# Altium project MB1167.PrjPCB (part 1 of 3)
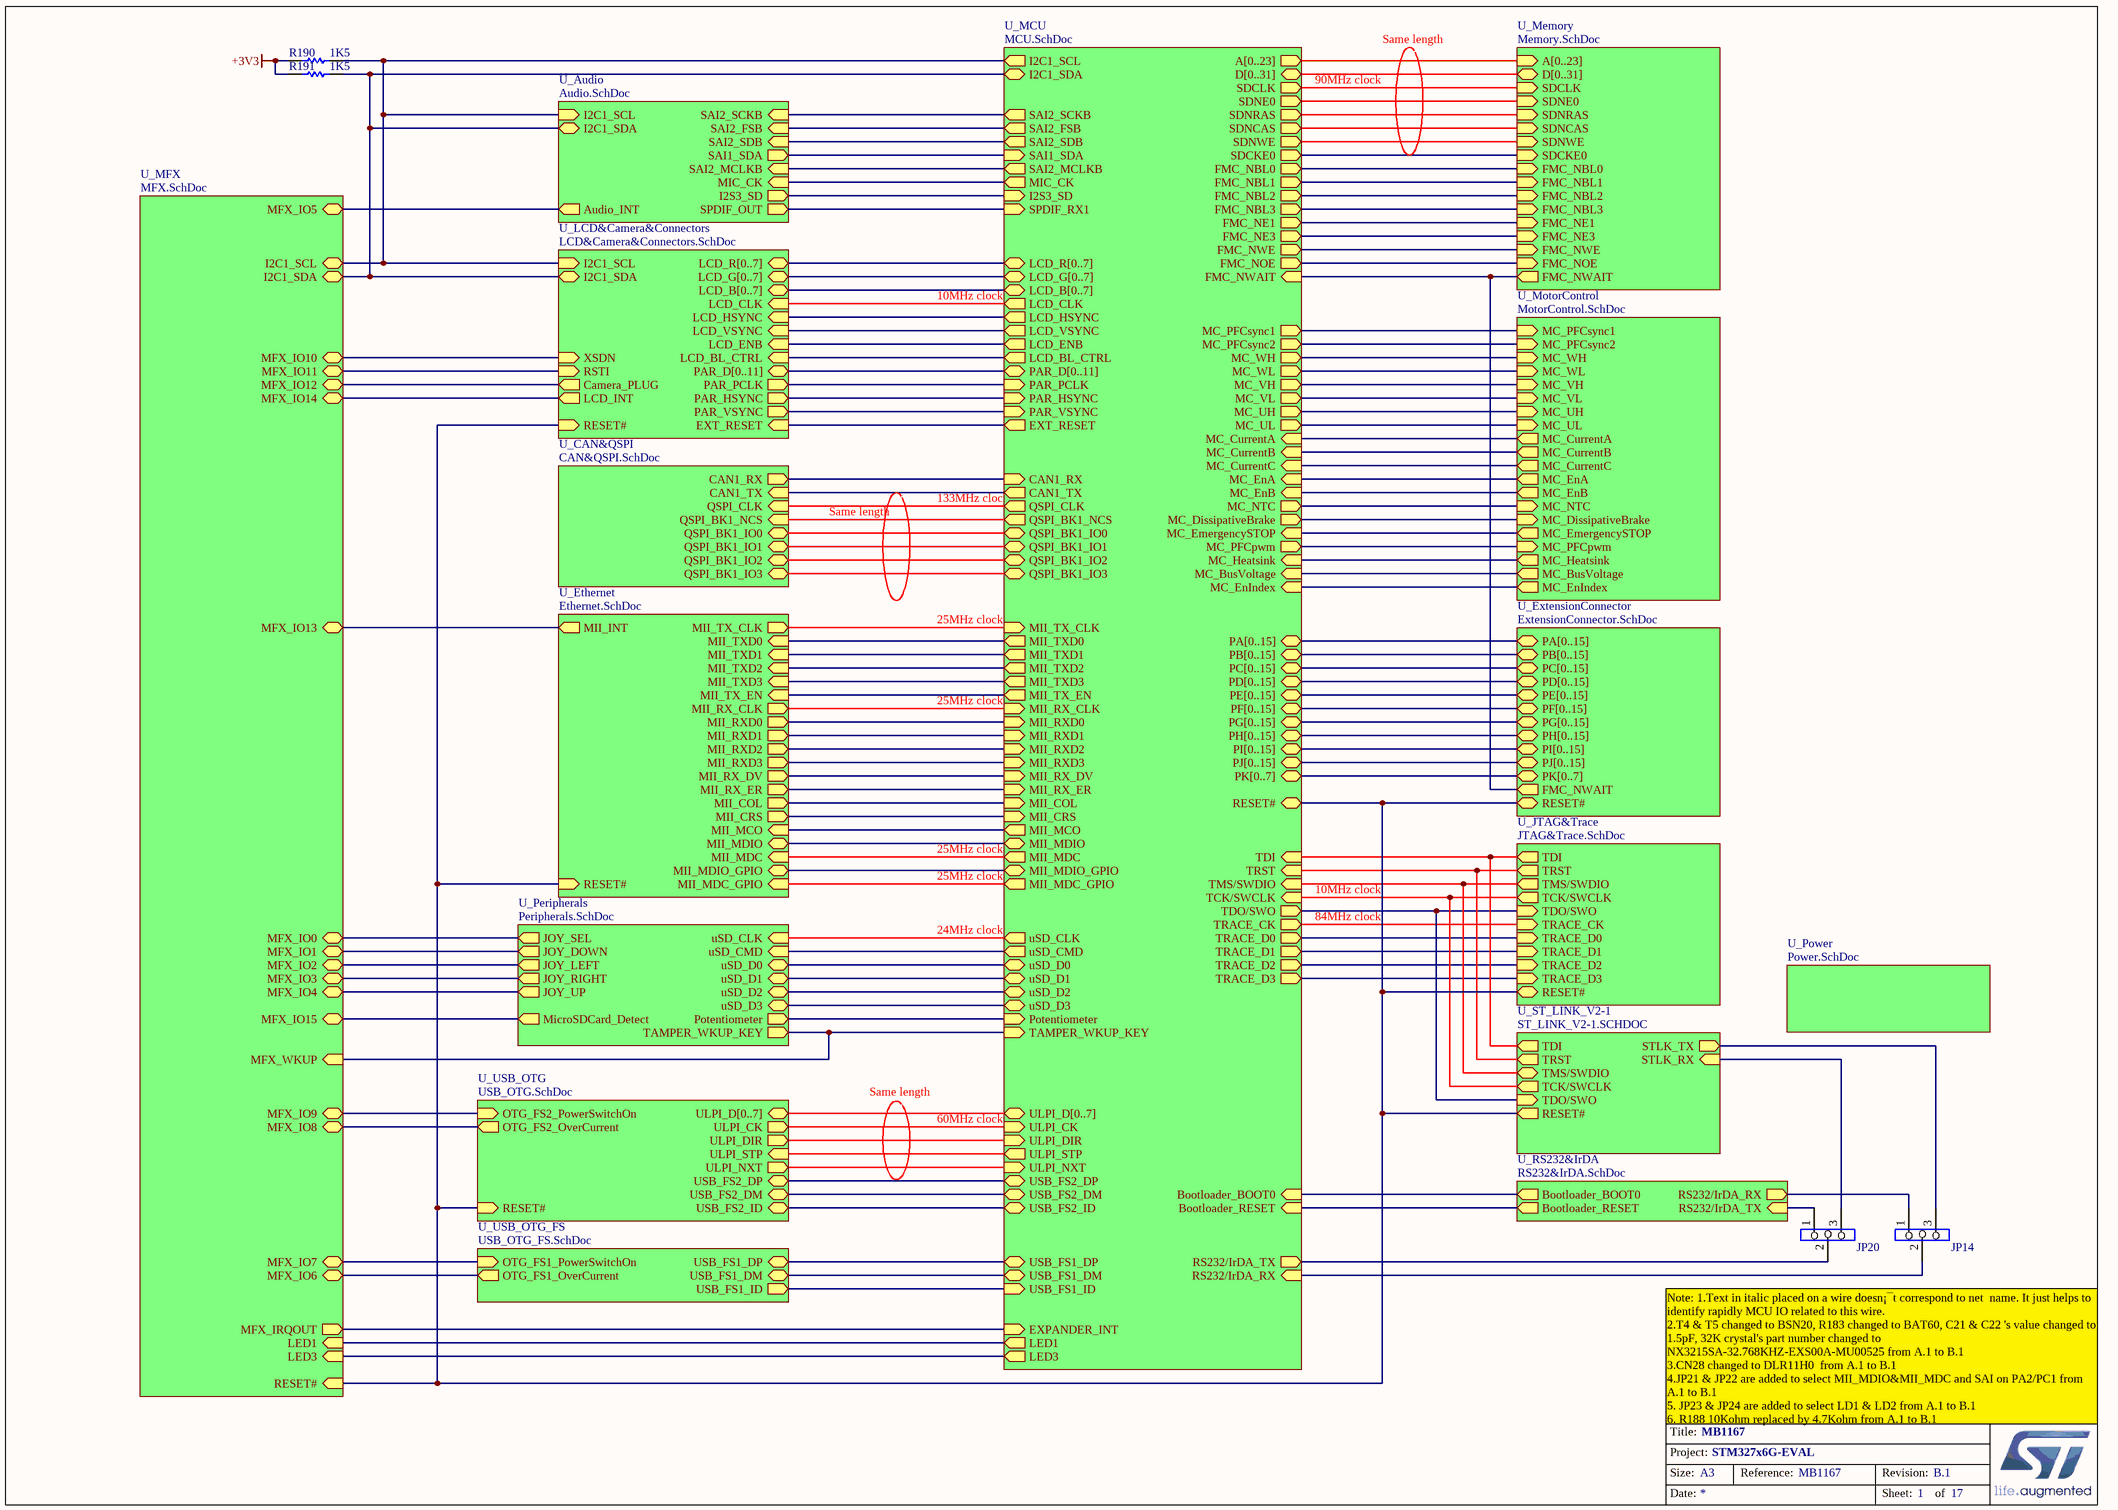
[diagram p0: MB1167.SchDoc]
17 sheets, 691 parts. Net scope: hierarchical (ports join the sheet entries above them; power ports are global).
Sheets:
  MB1167.SchDoc
    U_Audio = Audio.SchDoc
    U_CAN&QSPI = CAN&QSPI.SchDoc
    U_Ethernet = Ethernet.SchDoc
    U_ExtensionConnector = ExtensionConnector.SchDoc
    U_JTAG&Trace = JTAG&Trace.SchDoc
    U_Memory = Memory.SchDoc
    U_MotorControl = MotorControl.SchDoc
    U_Peripherals = Peripherals.SchDoc
    U_Power = Power.SchDoc
    U_ST_LINK_V2-1 = ST_LINK_V2-1.SCHDOC
    U_USB_OTG = USB_OTG.SchDoc
    U_USB_OTG_FS = USB_OTG_FS.SchDoc
    U_RS232&IrDA = RS232&IrDA.SchDoc
    U_LCD&Camera&Connectors = LCD&Camera&Connectors.SchDoc
    U_MFX = MFX.SchDoc
    U_MCU = MCU.SchDoc

## Sheet MB1167.SchDoc: MB1167
size A3; DocumentNumber: MB1167; Revision: B.1; SheetNumber: 1; SheetTotal: 17; Project: STM327x6G-EVAL

### Parts
JP14  (no value)  [SIP3]
JP20  (no value)  [SIP3]
R190  1K5  [0603R]
R191  1K5  [0603R]

### Sub-sheets
U_Audio = Audio.SchDoc: SAI2_SCKB (in), SAI2_FSB (in), SAI2_SDB (in), SAI1_SDA (out), Audio_INT (out), I2C1_SDA (bidir), I2C1_SCL (in), SAI2_MCLKB (in), MIC_CK (in), I2S3_SD (out), SPDIF_OUT (out)
U_CAN&QSPI = CAN&QSPI.SchDoc: CAN1_TX (in), CAN1_RX (out), QSPI_BK1_IO0 (bidir), QSPI_BK1_IO3 (bidir), QSPI_BK1_IO2 (bidir), QSPI_BK1_IO1 (bidir), QSPI_CLK (in), QSPI_BK1_NCS (in)
U_Ethernet = Ethernet.SchDoc: MII_TXD0 (in), MII_TX_EN (in), MII_TX_CLK (out), MII_RXD0 (out), MII_RX_ER (out), MII_RX_DV (out), MII_RX_CLK (out), MII_COL (out), MII_CRS (out), MII_MDC (in), MII_MDIO (bidir), RESET# (in), MII_TXD1 (in), MII_TXD2 (in), MII_TXD3 (in), MII_RXD1 (out), MII_RXD2 (out), MII_RXD3 (out), MII_INT (out), MII_MCO (in), MII_MDIO_GPIO (bidir), MII_MDC_GPIO (in)
U_ExtensionConnector = ExtensionConnector.SchDoc: PA[0..15] (bidir), PB[0..15] (bidir), PC[0..15] (bidir), PD[0..15] (bidir), PE[0..15] (bidir), PF[0..15] (bidir), PG[0..15] (bidir), PH[0..15] (bidir), PI[0..15] (bidir), PJ[0..15] (bidir), PK[0..7] (bidir), RESET# (bidir), FMC_NWAIT (out)
U_JTAG&Trace = JTAG&Trace.SchDoc: TDI (out), RESET# (bidir), TRACE_D3 (in), TRACE_D2 (in), TRACE_D1 (in), TRACE_D0 (in), TRACE_CK (in), TRST (out), TMS/SWDIO (out), TCK/SWCLK (out), TDO/SWO (in)
U_LCD&Camera&Connectors = LCD&Camera&Connectors.SchDoc: LCD_R[0..7] (bidir), LCD_HSYNC (in), LCD_VSYNC (in), LCD_CLK (in), LCD_ENB (in), LCD_BL_CTRL (in), I2C1_SDA (bidir), I2C1_SCL (in), LCD_B[0..7] (bidir), LCD_G[0..7] (bidir), RSTI (in), XSDN (in), PAR_HSYNC (out), PAR_PCLK (out), PAR_VSYNC (out), PAR_D[0..11] (bidir), EXT_RESET (in), LCD_INT (out), Camera_PLUG (out), RESET# (in)
U_MCU = MCU.SchDoc: PA[0..15] (bidir), PB[0..15] (bidir), PC[0..15] (bidir), PD[0..15] (bidir), PE[0..15] (bidir), PF[0..15] (bidir), PG[0..15] (bidir), PH[0..15] (bidir), PI[0..15] (bidir), MC_EnA (in), MII_RX_CLK (in), MC_EnB (in), MII_MDIO (bidir), MC_EnIndex (in), ULPI_CK (in), MC_EmergencySTOP (in), MII_RX_DV (in), MC_UL (out), LCD_BL_CTRL (out), MC_PFCsync1 (out), RS232/IrDA_TX (out), RS232/IrDA_RX (in), USB_FS1_ID (in), CAN1_RX (in), USB_FS1_DM (bidir), MC_PFCpwm (out), CAN1_TX (out), USB_FS1_DP (bidir), MC_PFCsync2 (out), TMS/SWDIO (in), TCK/SWCLK (in), TDI (in), MC_VL (out), MC_WL (out), TDO/SWO (out), MIC_CK (out), TRST (in), I2C1_SCL (out), MII_TXD3 (out), MC_DissipativeBrake (out), I2C1_SDA (bidir), USB_FS2_ID (bidir), USB_FS2_DM (bidir), USB_FS2_DP (bidir), ULPI_STP (out), MII_MDC (out), MC_CurrentA (in), MII_TXD2 (out), MC_CurrentB (in), MII_TX_CLK (in), MC_CurrentC (in), MII_RXD0 (in), MC_BusVoltage (in), MII_RXD1 (in), MC_Heatsink (in), MC_UH (out), MC_VH (out), uSD_D0 (bidir), MC_WH (out), uSD_D1 (bidir), uSD_D2 (bidir), EXT_RESET (out), uSD_D3 (bidir), uSD_CLK (out), TAMPER_WKUP_KEY (in), MII_CRS (in), LCD_ENB (out), uSD_CMD (out), FMC_NOE (out), FMC_NWE (out), FMC_NWAIT (in), I2S3_SD (in), FMC_NE1 (out), FMC_NBL3 (out), FMC_NBL2 (out), EXPANDER_INT (in), MII_RX_ER (in), ULPI_DIR (in), LCD_HSYNC (out), LCD_VSYNC (out), LCD_CLK (out), FMC_NBL0 (out), FMC_NBL1 (out), TRACE_CK (out), TRACE_D0 (out), TRACE_D2 (out), TRACE_D1 (out), SAI1_SDA (in), TRACE_D3 (out), SAI2_SDB (out), SAI2_SCKB (out), SAI2_FSB (out), SAI2_MCLKB (out), Potentiometer (in), SDNRAS (out), MII_MDIO_GPIO (bidir), MII_MDC_GPIO (out), SDCLK (out), FMC_NE3 (out), SPDIF_RX1 (in), MII_TX_EN (out), MC_NTC (out), MII_TXD0 (out), MII_TXD1 (out), SDNCAS (out), SDCKE0 (out), SDNE0 (out), MII_COL (in), ULPI_NXT (in), SDNWE (out), MII_RXD2 (in), MII_RXD3 (in), LCD_G[0..7] (bidir), LCD_B[0..7] (bidir), D[0..31] (bidir), A[0..23] (out), ULPI_D[0..7] (bidir), RESET# (bidir), PJ[0..15] (bidir), PK[0..7] (bidir), PAR_VSYNC (in), PAR_D[0..11] (bidir), PAR_PCLK (in), PAR_HSYNC (in), MII_MCO (out), LCD_R[0..7] (bidir), Bootloader_BOOT0 (in), QSPI_CLK (out), QSPI_BK1_NCS (out), QSPI_BK1_IO3 (bidir), QSPI_BK1_IO2 (bidir), QSPI_BK1_IO1 (bidir), QSPI_BK1_IO0 (bidir), Bootloader_RESET (in), LED1 (out), LED3 (out)
U_Memory = Memory.SchDoc: FMC_NE1 (in), FMC_NWE (in), FMC_NOE (in), FMC_NWAIT (out), FMC_NBL0 (in), FMC_NBL1 (in), D[0..31] (bidir), A[0..23] (in), SDNCAS (in), SDNWE (in), SDNRAS (in), SDNE0 (in), SDCKE0 (in), SDCLK (in), FMC_NBL3 (in), FMC_NBL2 (in), FMC_NE3 (in)
U_MFX = MFX.SchDoc: I2C1_SDA (bidir), I2C1_SCL (bidir), MFX_IO5 (bidir), MFX_IO6 (bidir), MFX_IO7 (bidir), MFX_IO8 (bidir), MFX_IO9 (bidir), MFX_IO10 (bidir), MFX_IO11 (bidir), MFX_IO12 (bidir), MFX_IO13 (bidir), MFX_IO14 (bidir), MFX_IO15 (bidir), MFX_IO0 (bidir), MFX_IO1 (bidir), MFX_IO2 (bidir), MFX_IO3 (bidir), MFX_IO4 (bidir), MFX_IRQOUT (out), MFX_WKUP (in), RESET# (in), LED1 (in), LED3 (in)
U_MotorControl = MotorControl.SchDoc: MC_EmergencySTOP (out), MC_CurrentA (out), MC_CurrentB (out), MC_CurrentC (out), MC_PFCsync1 (in), MC_PFCsync2 (in), MC_WL (in), MC_VH (in), MC_VL (in), MC_UH (in), MC_UL (in), MC_WH (in), MC_NTC (in), MC_DissipativeBrake (in), MC_PFCpwm (in), MC_EnA (out), MC_EnB (out), MC_Heatsink (out), MC_BusVoltage (out), MC_EnIndex (out)
U_Peripherals = Peripherals.SchDoc: JOY_SEL (out), JOY_DOWN (out), JOY_LEFT (out), JOY_RIGHT (out), JOY_UP (out), Potentiometer (out), TAMPER_WKUP_KEY (out), uSD_CLK (in), uSD_CMD (in), uSD_D0 (bidir), uSD_D1 (bidir), uSD_D2 (bidir), uSD_D3 (bidir), MicroSDCard_Detect (out)
U_Power = Power.SchDoc: no entries
U_RS232&IrDA = RS232&IrDA.SchDoc: RS232/IrDA_TX (in), RS232/IrDA_RX (out), Bootloader_BOOT0 (out), Bootloader_RESET (out)
U_ST_LINK_V2-1 = ST_LINK_V2-1.SCHDOC: STLK_RX (in), STLK_TX (out), TDI (out), TRST (out), TMS/SWDIO (bidir), TCK/SWCLK (out), TDO/SWO (in), RESET# (out)
U_USB_OTG = USB_OTG.SchDoc: ULPI_D[0..7] (bidir), ULPI_CK (out), ULPI_DIR (out), ULPI_NXT (out), ULPI_STP (in), RESET# (in), USB_FS2_DM (bidir), USB_FS2_DP (bidir), OTG_FS2_PowerSwitchOn (in), OTG_FS2_OverCurrent (out), USB_FS2_ID (bidir)
U_USB_OTG_FS = USB_OTG_FS.SchDoc: OTG_FS1_PowerSwitchOn (in), OTG_FS1_OverCurrent (out), USB_FS1_DM (bidir), USB_FS1_DP (bidir), USB_FS1_ID (out)

### Nets
+3V3: R190.1 R191.1
I2C1_SCL: R190.2 ; sheet U_Audio/I2C1_SCL, sheet U_LCD&Camera&Connectors/I2C1_SCL, sheet U_MFX/I2C1_SCL, sheet U_MCU/I2C1_SCL
I2C1_SDA: R191.2 ; sheet U_Audio/I2C1_SDA, sheet U_LCD&Camera&Connectors/I2C1_SDA, sheet U_MFX/I2C1_SDA, sheet U_MCU/I2C1_SDA
PA4: sheet U_LCD&Camera&Connectors/PAR_HSYNC, sheet U_MCU/PAR_HSYNC
PA5: sheet U_USB_OTG/ULPI_CK, sheet U_MCU/ULPI_CK
PA6: sheet U_MotorControl/MC_EmergencySTOP, sheet U_MCU/MC_EmergencySTOP
PA10: JP14.2 ; sheet U_USB_OTG_FS/USB_FS1_ID, sheet U_MCU/RS232/IrDA_RX, sheet U_MCU/USB_FS1_ID
PA11: sheet U_USB_OTG_FS/USB_FS1_DM, sheet U_MCU/USB_FS1_DM
PA13: sheet U_JTAG&Trace/TMS/SWDIO, sheet U_ST_LINK_V2-1/TMS/SWDIO, sheet U_MCU/TMS/SWDIO
PA14: sheet U_JTAG&Trace/TCK/SWCLK, sheet U_ST_LINK_V2-1/TCK/SWCLK, sheet U_MCU/TCK/SWCLK
PA15: sheet U_JTAG&Trace/TDI, sheet U_ST_LINK_V2-1/TDI, sheet U_MCU/TDI
PAR_D1: sheet U_MotorControl/MC_VH, sheet U_MCU/MC_VH
PAR_D8: sheet U_LCD&Camera&Connectors/EXT_RESET, sheet U_MCU/EXT_RESET
PAR_D9: sheet U_Peripherals/uSD_CLK, sheet U_MCU/uSD_CLK
PB2: sheet U_CAN&QSPI/QSPI_CLK, sheet U_MCU/QSPI_CLK
PB4: sheet U_JTAG&Trace/TRST, sheet U_ST_LINK_V2-1/TRST, sheet U_MCU/TRST
PB6: sheet U_CAN&QSPI/QSPI_BK1_NCS, sheet U_MCU/QSPI_BK1_NCS
PB14: sheet U_USB_OTG/USB_FS2_DM, sheet U_MCU/USB_FS2_DM
PB15: sheet U_USB_OTG/USB_FS2_DP, sheet U_MCU/USB_FS2_DP
PC0: sheet U_USB_OTG/ULPI_STP, sheet U_MCU/ULPI_STP
PC13: sheet U_Peripherals/TAMPER_WKUP_KEY, sheet U_MFX/MFX_WKUP, sheet U_MCU/TAMPER_WKUP_KEY
PD4: sheet U_Memory/FMC_NOE, sheet U_MCU/FMC_NOE
PD5: sheet U_Memory/FMC_NWE, sheet U_MCU/FMC_NWE
PD7: sheet U_Memory/FMC_NE1, sheet U_MCU/FMC_NE1
PE0: sheet U_Memory/FMC_NBL0, sheet U_MCU/FMC_NBL0
PE1: sheet U_Memory/FMC_NBL1, sheet U_MCU/FMC_NBL1
PF6: sheet U_CAN&QSPI/QSPI_BK1_IO3, sheet U_MCU/QSPI_BK1_IO3
PF7: sheet U_CAN&QSPI/QSPI_BK1_IO2, sheet U_MCU/QSPI_BK1_IO2
PF8: sheet U_CAN&QSPI/QSPI_BK1_IO0, sheet U_MCU/QSPI_BK1_IO0
PF9: sheet U_CAN&QSPI/QSPI_BK1_IO1, sheet U_MCU/QSPI_BK1_IO1
PF11: sheet U_Memory/SDNRAS, sheet U_MCU/SDNRAS
PG8: sheet U_Memory/SDCLK, sheet U_MCU/SDCLK
PG9: sheet U_Audio/SAI2_FSB, sheet U_MCU/SAI2_FSB
PG10: sheet U_Memory/FMC_NE3, sheet U_MCU/FMC_NE3
PG12: sheet U_Audio/SPDIF_OUT, sheet U_MCU/SPDIF_RX1
PG15: sheet U_Memory/SDNCAS, sheet U_MCU/SDNCAS
PH2: sheet U_Memory/SDCKE0, sheet U_MCU/SDCKE0
PH3: sheet U_Memory/SDNE0, sheet U_MCU/SDNE0
PH4: sheet U_USB_OTG/ULPI_NXT, sheet U_MCU/ULPI_NXT
PH5: sheet U_Memory/SDNWE, sheet U_MCU/SDNWE
PH7: sheet U_Ethernet/MII_RXD3, sheet U_MCU/MII_RXD3
PI4: sheet U_Memory/FMC_NBL2, sheet U_MCU/FMC_NBL2
PI5: sheet U_Memory/FMC_NBL3, sheet U_MCU/FMC_NBL3
PI8: sheet U_MFX/MFX_IRQOUT, sheet U_MCU/EXPANDER_INT
PI11: sheet U_USB_OTG/ULPI_DIR, sheet U_MCU/ULPI_DIR
PI12: sheet U_LCD&Camera&Connectors/LCD_HSYNC, sheet U_MCU/LCD_HSYNC
PI13: sheet U_LCD&Camera&Connectors/LCD_VSYNC, sheet U_MCU/LCD_VSYNC
PI14: sheet U_LCD&Camera&Connectors/LCD_CLK, sheet U_MCU/LCD_CLK
PK7: sheet U_LCD&Camera&Connectors/LCD_ENB, sheet U_MCU/LCD_ENB
RESET#: sheet U_Ethernet/RESET#, sheet U_ExtensionConnector/RESET#, sheet U_JTAG&Trace/RESET#, sheet U_ST_LINK_V2-1/RESET#, sheet U_USB_OTG/RESET#, sheet U_LCD&Camera&Connectors/RESET#, sheet U_MFX/RESET#, sheet U_MCU/RESET#
STLINK_RX: JP20.3 ; sheet U_ST_LINK_V2-1/STLK_RX
STLINK_TX: JP14.3 ; sheet U_ST_LINK_V2-1/STLK_TX
T_JTDO: sheet U_JTAG&Trace/TDO/SWO, sheet U_ST_LINK_V2-1/TDO/SWO, sheet U_MCU/TDO/SWO
NetB3_1: sheet U_Peripherals/JOY_LEFT, sheet U_MFX/MFX_IO2
NetB3_2: sheet U_Peripherals/JOY_SEL, sheet U_MFX/MFX_IO0
NetB3_3: sheet U_Peripherals/JOY_DOWN, sheet U_MFX/MFX_IO1
NetB3_4: sheet U_Peripherals/JOY_RIGHT, sheet U_MFX/MFX_IO3
NetB3_6: sheet U_Peripherals/JOY_UP, sheet U_MFX/MFX_IO4
NetC6_2: sheet U_MotorControl/MC_EnA, sheet U_MCU/MC_EnA
NetC7_2: sheet U_MotorControl/MC_PFCsync2, sheet U_MCU/MC_PFCsync2
NetC8_2: sheet U_MotorControl/MC_EnB, sheet U_MCU/MC_EnB
NetC9_2: sheet U_MotorControl/MC_EnIndex, sheet U_MCU/MC_EnIndex
NetC10_2: sheet U_MotorControl/MC_PFCpwm, sheet U_MCU/MC_PFCpwm
NetC11_1: sheet U_MotorControl/MC_Heatsink, sheet U_MCU/MC_Heatsink
NetC12_2: sheet U_MotorControl/MC_CurrentC, sheet U_MCU/MC_CurrentC
NetC13_2: sheet U_MotorControl/MC_CurrentB, sheet U_MCU/MC_CurrentB
NetC14_2: sheet U_MotorControl/MC_CurrentA, sheet U_MCU/MC_CurrentA
NetC15_1: sheet U_MotorControl/MC_BusVoltage, sheet U_MCU/MC_BusVoltage
NetC18_2: sheet U_MotorControl/MC_PFCsync1, sheet U_MCU/MC_PFCsync1
NetCN1_3: sheet U_MotorControl/MC_UH, sheet U_MCU/MC_UH
NetCN1_5: sheet U_MotorControl/MC_UL, sheet U_MCU/MC_UL
NetCN1_9: sheet U_MotorControl/MC_VL, sheet U_MCU/MC_VL
NetCN1_11: sheet U_MotorControl/MC_WH, sheet U_MCU/MC_WH
NetCN1_13: sheet U_MotorControl/MC_WL, sheet U_MCU/MC_WL
NetCN1_21: sheet U_MotorControl/MC_NTC, sheet U_MCU/MC_NTC
NetCN1_23: sheet U_MotorControl/MC_DissipativeBrake, sheet U_MCU/MC_DissipativeBrake
NetCN4_15: sheet U_LCD&Camera&Connectors/Camera_PLUG, sheet U_MFX/MFX_IO12
NetCN4_17: sheet U_LCD&Camera&Connectors/RSTI, sheet U_MFX/MFX_IO11
NetCN4_19: sheet U_LCD&Camera&Connectors/XSDN, sheet U_MFX/MFX_IO10
NetCN4_32: sheet U_LCD&Camera&Connectors/PAR_VSYNC, sheet U_MCU/PAR_VSYNC
NetCN4_33: sheet U_LCD&Camera&Connectors/PAR_PCLK, sheet U_MCU/PAR_PCLK
NetCN11_6: sheet U_ExtensionConnector/FMC_NWAIT, sheet U_Memory/FMC_NWAIT, sheet U_MCU/FMC_NWAIT
NetCN12_12: sheet U_JTAG&Trace/TRACE_CK, sheet U_MCU/TRACE_CK
NetCN12_14: sheet U_JTAG&Trace/TRACE_D0, sheet U_MCU/TRACE_D0
NetCN12_16: sheet U_JTAG&Trace/TRACE_D1, sheet U_MCU/TRACE_D1
NetCN12_18: sheet U_JTAG&Trace/TRACE_D2, sheet U_MCU/TRACE_D2
NetCN12_20: sheet U_JTAG&Trace/TRACE_D3, sheet U_MCU/TRACE_D3
NetCN14_4: sheet U_USB_OTG/USB_FS2_ID, sheet U_MCU/USB_FS2_ID
NetCN16_1: sheet U_Peripherals/uSD_D2, sheet U_MCU/uSD_D2
NetCN16_2: sheet U_Peripherals/uSD_D3, sheet U_MCU/uSD_D3
NetCN16_3: sheet U_Peripherals/uSD_CMD, sheet U_MCU/uSD_CMD
NetCN16_7: sheet U_Peripherals/uSD_D0, sheet U_MCU/uSD_D0
NetCN16_8: sheet U_Peripherals/uSD_D1, sheet U_MCU/uSD_D1
NetCN20_39: sheet U_LCD&Camera&Connectors/LCD_INT, sheet U_MFX/MFX_IO14
NetCN20_43: sheet U_LCD&Camera&Connectors/LCD_BL_CTRL, sheet U_MCU/LCD_BL_CTRL
NetD1_1: sheet U_RS232&IrDA/Bootloader_BOOT0, sheet U_MCU/Bootloader_BOOT0
NetD5_C3: sheet U_USB_OTG_FS/USB_FS1_DP, sheet U_MCU/USB_FS1_DP
NetJP3_2: sheet U_RS232&IrDA/Bootloader_RESET, sheet U_MCU/Bootloader_RESET
NetJP5_3: sheet U_Audio/I2S3_SD, sheet U_MCU/I2S3_SD
NetJP6_3: sheet U_Ethernet/MII_MCO, sheet U_MCU/MII_MCO
NetJP7_2: JP14.1 ; sheet U_RS232&IrDA/RS232/IrDA_RX
NetJP8_2: sheet U_CAN&QSPI/CAN1_RX, sheet U_MCU/CAN1_RX
NetJP19_3: sheet U_Audio/MIC_CK, sheet U_MCU/MIC_CK
NetJP20_1: JP20.1 ; sheet U_RS232&IrDA/RS232/IrDA_TX
NetJP20_2: JP20.2 ; sheet U_MCU/RS232/IrDA_TX
NetJP21_1: sheet U_Audio/SAI2_SCKB, sheet U_MCU/SAI2_SCKB
NetJP21_3: sheet U_Ethernet/MII_MDIO, sheet U_Ethernet/MII_MDIO_GPIO, sheet U_MCU/MII_MDIO, sheet U_MCU/MII_MDIO_GPIO
NetJP22_1: sheet U_Audio/SAI1_SDA, sheet U_MCU/SAI1_SDA
NetJP22_3: sheet U_Ethernet/MII_MDC, sheet U_Ethernet/MII_MDC_GPIO, sheet U_MCU/MII_MDC, sheet U_MCU/MII_MDC_GPIO
NetJP23_3: sheet U_MFX/LED3, sheet U_MCU/LED3
NetJP24_1: sheet U_Peripherals/Potentiometer, sheet U_MCU/Potentiometer
NetJP24_3: sheet U_MFX/LED1, sheet U_MCU/LED1
NetR46_2: sheet U_Ethernet/MII_RXD2, sheet U_MCU/MII_RXD2
NetR47_2: sheet U_Ethernet/MII_RXD1, sheet U_MCU/MII_RXD1
NetR48_2: sheet U_Ethernet/MII_RXD0, sheet U_MCU/MII_RXD0
NetR49_2: sheet U_Ethernet/MII_RX_DV, sheet U_MCU/MII_RX_DV
NetR50_2: sheet U_Ethernet/MII_RX_CLK, sheet U_MCU/MII_RX_CLK
NetR62_2: sheet U_Ethernet/MII_TX_CLK, sheet U_MCU/MII_TX_CLK
NetR74_2: sheet U_Ethernet/MII_INT, sheet U_MFX/MFX_IO13
NetR121_1: sheet U_USB_OTG/OTG_FS2_OverCurrent, sheet U_MFX/MFX_IO8
NetR130_2: sheet U_USB_OTG_FS/OTG_FS1_PowerSwitchOn, sheet U_MFX/MFX_IO7
NetR132_1: sheet U_USB_OTG_FS/OTG_FS1_OverCurrent, sheet U_MFX/MFX_IO6
NetR154_1: sheet U_Peripherals/MicroSDCard_Detect, sheet U_MFX/MFX_IO15
NetR241_2: sheet U_Ethernet/MII_TXD2, sheet U_MCU/MII_TXD2
NetR243_2: sheet U_Ethernet/MII_TXD0, sheet U_MCU/MII_TXD0
NetR244_2: sheet U_Ethernet/MII_TXD1, sheet U_MCU/MII_TXD1
NetR247_1: sheet U_Ethernet/MII_TXD3, sheet U_MCU/MII_TXD3
NetR252_2: sheet U_Ethernet/MII_TX_EN, sheet U_MCU/MII_TX_EN
NetSB9_2: sheet U_Ethernet/MII_RX_ER, sheet U_MCU/MII_RX_ER
NetSB14_1: sheet U_USB_OTG/OTG_FS2_PowerSwitchOn, sheet U_MFX/MFX_IO9
NetSB18_1: sheet U_Audio/SAI2_MCLKB, sheet U_MCU/SAI2_MCLKB
NetSB32_1: sheet U_Audio/SAI2_SDB, sheet U_MCU/SAI2_SDB
NetSB36_1: sheet U_Ethernet/MII_CRS, sheet U_MCU/MII_CRS
NetSB47_2: sheet U_Ethernet/MII_COL, sheet U_MCU/MII_COL
NetSB49_1: sheet U_CAN&QSPI/CAN1_TX, sheet U_MCU/CAN1_TX
NetU22_15: sheet U_Audio/Audio_INT, sheet U_MFX/MFX_IO5

### Buses and harness runs
bus sheet U_ExtensionConnector/PA[0..15] = sheet U_MCU/PA[0..15]
bus sheet U_ExtensionConnector/PB[0..15] = sheet U_MCU/PB[0..15]
bus sheet U_ExtensionConnector/PC[0..15] = sheet U_MCU/PC[0..15]
bus sheet U_ExtensionConnector/PD[0..15] = sheet U_MCU/PD[0..15]
bus sheet U_ExtensionConnector/PE[0..15] = sheet U_MCU/PE[0..15]
bus sheet U_ExtensionConnector/PF[0..15] = sheet U_MCU/PF[0..15]
bus sheet U_ExtensionConnector/PG[0..15] = sheet U_MCU/PG[0..15]
bus sheet U_ExtensionConnector/PH[0..15] = sheet U_MCU/PH[0..15]
bus sheet U_ExtensionConnector/PI[0..15] = sheet U_MCU/PI[0..15]
bus sheet U_ExtensionConnector/PJ[0..15] = sheet U_MCU/PJ[0..15]
bus sheet U_ExtensionConnector/PK[0..7] = sheet U_MCU/PK[0..7]
bus sheet U_LCD&Camera&Connectors/LCD_B[0..7] = sheet U_MCU/LCD_B[0..7]
bus sheet U_LCD&Camera&Connectors/LCD_G[0..7] = sheet U_MCU/LCD_G[0..7]
bus sheet U_LCD&Camera&Connectors/LCD_R[0..7] = sheet U_MCU/LCD_R[0..7]
bus sheet U_LCD&Camera&Connectors/PAR_D[0..11] = sheet U_MCU/PAR_D[0..11]
bus sheet U_MCU/A[0..23] = sheet U_Memory/A[0..23]
bus sheet U_MCU/D[0..31] = sheet U_Memory/D[0..31]
bus sheet U_MCU/ULPI_D[0..7] = sheet U_USB_OTG/ULPI_D[0..7]

### Notes on the sheet
- Same length
- 90MHz clock
- 10MHz clock
- 133MHz clock
- 25MHz clock
- 84MHz clock
- 24MHz clock
- 60MHz clock
- Note: 1.Text in italic placed on a wire doesn¡¯t correspond to net  name. It just helps to identify rapidly MCU IO related to this wire.
  2.T4 & T5 changed to BSN20, R183 changed to BAT60, C21 & C22 's value changed to 1.5pF, 32K crystal's part number changed to NX3215SA-32.768KHZ-EXS00A-MU00525 from A.1 to B.1
  3.CN28 changed to DLR11H0  from A.1 to B.1
  4.JP21 & JP22 are added to select MII_MDIO&MII_MDC and SAI on PA2/PC1 from A.1 to B.1
  5. JP23 & JP24 are added to select LD1 & LD2 from A.1 to B.1
  6. R188 10Kohm replaced by 4.7Kohm from A.1 to B.1
- Title:
- Project:
- Size:
- Date:
- A3
- Reference:
- Sheet:
- Revision:
- of

### Library data of the parts
JP14 JP20 = Jumper3
R190 R191 = Res1: Resistor; Value: 1K; Published: 8-Jun-2000; Revision: July-2002: Re-released for DXP Platform.; Publisher: Altium Limited

## Sheet Audio.SchDoc: Audio
size A4; DocumentNumber: MB1167; Revision: B.1; SheetNumber: 5; SheetTotal: 17; Project: STM327x6G-EVAL
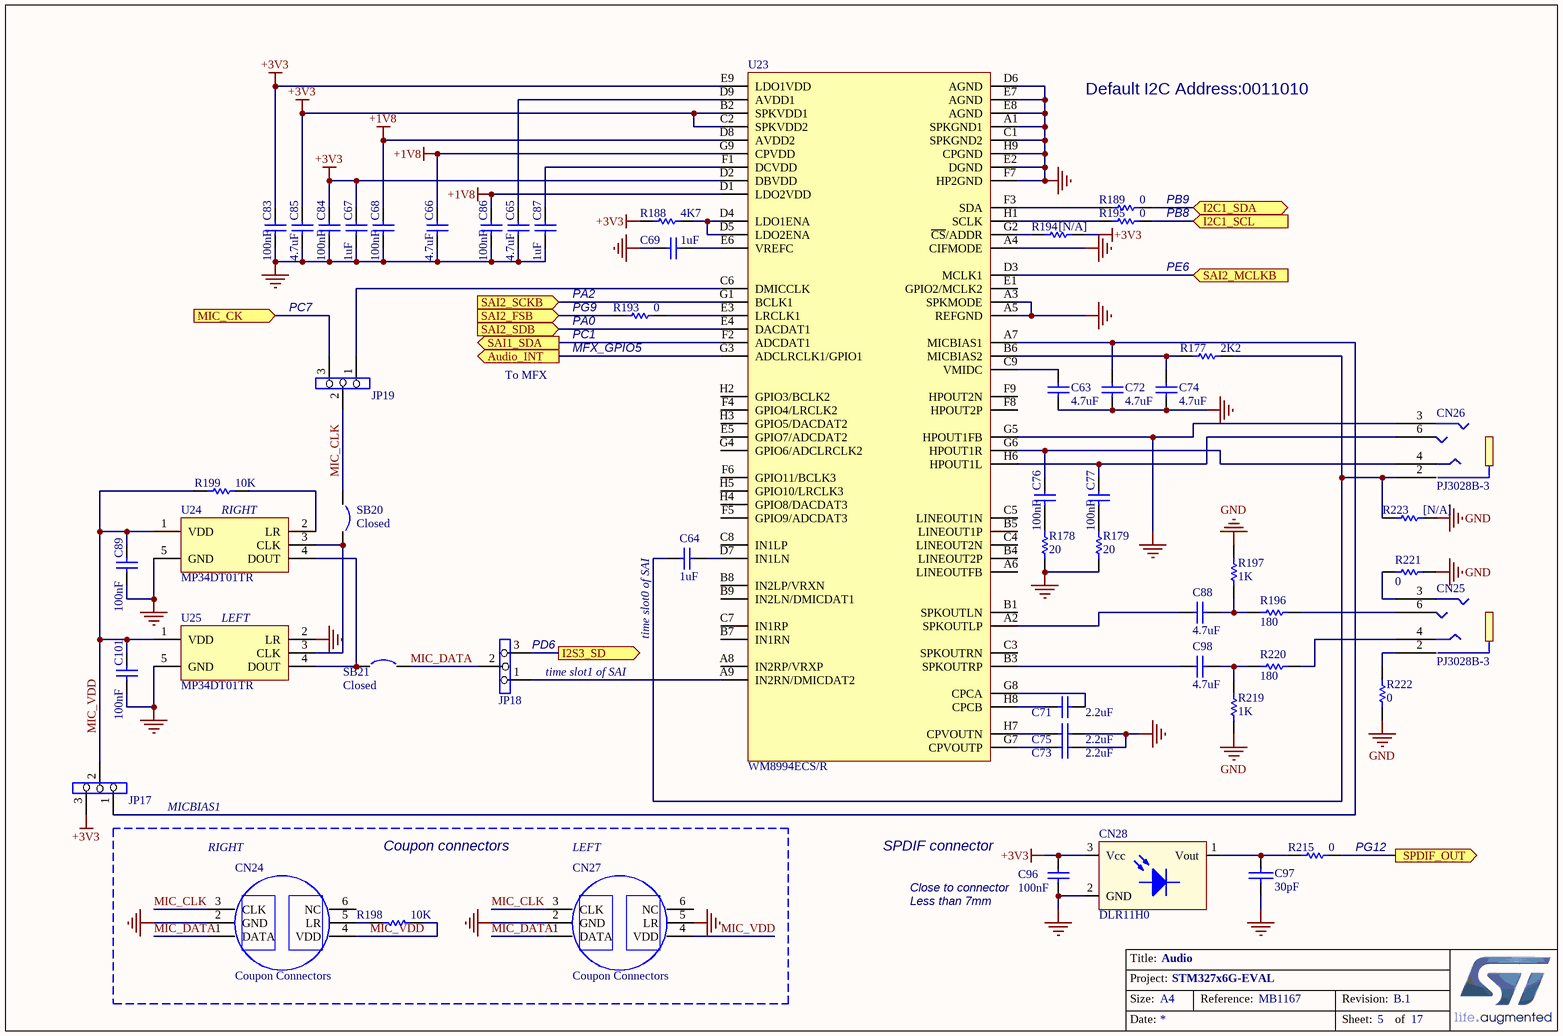
[diagram p1: Audio.SchDoc]

### Parts
C63  4.7uF  [0603C]
C64  1uF  [0603C]
C65  4.7uF  [0603C]
C66  4.7uF  [0603C]
C67  1uF  [0603C]
C68  100nF  [0603C]
C69  1uF  [0603C]
C71  2.2uF  [0603C]
C72  4.7uF  [0603C]
C73  2.2uF  [0603C]
C74  4.7uF  [0603C]
C75  2.2uF  [0603C]
C76  100nF  [0603C]
C77  100nF  [0603C]
C83  100nF  [0603C]
C84  100nF  [0603C]
C85  4.7uF  [0603C]
C86  100nF  [0603C]
C87  1uF  [0603C]
C88  4.7uF  [0603C]
C89  100nF  [0603C]
C96  100nF  [0603C]
C97  30pF  [0603C]
C98  4.7uF  [0603C]
C101  100nF  [0603C]
CN24  Coupon Connectors  [Coupon]
CN25  PJ3028B-3  [PJ3028B]
CN26  PJ3028B-3  [PJ3028B]
CN27  Coupon Connectors  [Coupon]
CN28  DLR11H0  [CONN_DLR11H0]
JP17  (no value)  [SIP3]
JP18  (no value)  [SIP3]
JP19  (no value)  [SIP3]
R177  2K2  [0603R]
R178  20  [0603R]
R179  20  [0603R]
R188  4K7  [0603R]
R189  0  [0603R]
R193  0  [0603R]
R194  [N/A]  [0603R]
R195  0  [0603R]
R196  180  [0402R]
R197  1K  [0402R]
R198  10K  [0603R]
R199  10K  [0603R]
R215  0  [0603R]
R219  1K  [0402R]
R220  180  [0402R]
R221  0  [0603R]
R222  0  [0603R]
R223  [N/A]  [0603R]
SB20  Closed  [SB_0603]
SB21  Closed  [SB_0603]
U23  WM8994ECS/R  [BGA72_0R5_4R5X4]
U24  MP34DT01TR  [MP34DT01TR]
U25  MP34DT01TR  [MP34DT01TR]

### Blocks framed on the sheet
Coupon connectors: CN24 CN27 R198

### Ports
Audio_INT (out), I2C1_SCL (in), I2C1_SDA (bidir), I2S3_SD (out), MIC_CK (in), SAI1_SDA (out), SAI2_FSB (in), SAI2_MCLKB (in), SAI2_SCKB (in), SAI2_SDB (in), SPDIF_OUT (out)

### Nets
+1V8: C66.1 C68.1 C86.1 U23.D1(LDO2VDD) U23.D8(AVDD2) U23.G9(CPVDD)
+3V3: C67.1 C83.1 C84.1 C85.1 C96.2 CN28.3(Vcc) JP17.3 R188.2 R194.1 U23.B2(SPKVDD1) U23.C2(SPKVDD2) U23.D2(DBVDD) U23.E9(LDO1VDD)
GND: C63.1 C65.2 C66.2 C67.2 C68.2 C69.2 C72.1 C73.2 C74.1 C75.2 C83.2 C84.2 C85.2 C86.2 C87.2 C89.2 C96.1 C97.2 C101.2 CN24.2(GND) CN26.3 CN27.2(GND) CN27.5(LR) CN28.2(GND) R178.2 R179.2 R197.2 R219.1 R221.2 R222.2 R223.1 U23.A1(SPKGND1) U23.A3(SPKMODE) U23.A4(CIFMODE) U23.A5(REFGND) U23.C1(SPKGND2) U23.D6(AGND) U23.E2(DGND) U23.E7(AGND) U23.E8(AGND) U23.F7(HP2GND) U23.G5(HPOUT1FB) U23.H9(CPGND) U24.5(GND) U25.2(LR) U25.5(GND)
I2C1_SCL: R195.1 ; port I2C1_SCL
I2C1_SDA: R189.1 ; port I2C1_SDA
MIC_CLK: CN24.3(CLK) CN27.3(CLK) JP19.2 SB20.1
MIC_DATA: CN24.1(DATA) CN27.1(DATA) JP18.2 SB21.2
MIC_VDD: C89.1 C101.1 CN24.4(VDD) CN27.4(VDD) JP17.2 R198.2 R199.2 U24.1(VDD) U25.1(VDD)
PG9: R193.2 ; port SAI2_FSB
PG12: R215.1 ; port SPDIF_OUT
NetC63_2: C63.2 U23.C9(VMIDC)
NetC64_1: C64.1 U23.D7(IN1LN)
NetC64_2: C64.2 CN26.2 R177.1 R223.2
NetC65_1: C65.1 U23.D9(AVDD1)
NetC69_1: C69.1 U23.E6(VREFC)
NetC71_1: C71.1 U23.H8(CPCB)
NetC71_2: C71.2 U23.G8(CPCA)
NetC72_2: C72.2 JP17.1 U23.A7(MICBIAS1)
NetC73_1: C73.1 U23.G7(CPVOUTP)
NetC74_2: C74.2 R177.2 U23.B6(MICBIAS2)
NetC75_1: C75.1 U23.H7(CPVOUTN)
NetC76_1: C76.1 CN26.4 U23.G6(HPOUT1R)
NetC76_2: C76.2 R178.1
NetC77_1: C77.1 CN26.6 U23.H6(HPOUT1L)
NetC77_2: C77.2 R179.1
NetC87_1: C87.1 U23.F1(DCVDD)
NetC88_1: C88.1 R196.1 R197.1
NetC88_2: C88.2 U23.A2(SPKOUTLP)
NetC97_1: C97.1 CN28.1(Vout) R215.2
NetC98_1: C98.1 R219.2 R220.2
NetC98_2: C98.2 U23.B3(SPKOUTRP)
NetCN24_5: CN24.5(LR) R198.1
NetCN25_2: CN25.2 R222.1
NetCN25_3: CN25.3 R221.1
NetCN25_4: CN25.4 R220.1
NetCN25_6: CN25.6 R196.2
NetJP5_3: JP18.3 ; port I2S3_SD
NetJP18_1: JP18.1 U23.A9(IN2RN/DMICDAT2)
NetJP19_1: JP19.1 U23.C6(DMICCLK)
NetJP19_3: JP19.3 ; port MIC_CK
NetJP21_1: U23.G1(BCLK1) ; port SAI2_SCKB
NetJP22_1: U23.F2(ADCDAT1) ; port SAI1_SDA
NetR188_1: R188.1 U23.D4(LDO1ENA) U23.D5(LDO2ENA)
NetR189_2: R189.2 U23.F3(SDA)
NetR193_1: R193.1 U23.E3(LRCLK1)
NetR194_2: R194.2 U23.G2(~{CS}/ADDR)
NetR195_2: R195.2 U23.H1(SCLK)
NetR199_1: R199.1 U24.2(LR)
NetSB18_1: U23.D3(MCLK1) ; port SAI2_MCLKB
NetSB20_2: SB20.2 U24.3(CLK) U25.3(CLK)
NetSB21_1: SB21.1 U24.4(DOUT) U25.4(DOUT)
NetSB32_1: U23.E4(DACDAT1) ; port SAI2_SDB
NetU22_15: U23.G3(ADCLRCLK1/GPIO1) ; port Audio_INT

Not connected (* = marked no-connect by the designer): CN24 6(NC); CN27 6(NC); U23 A6(LINEOUTFB) A8(IN2RP/VRXP) B1(SPKOUTLN) B4(LINEOUT2P) B5(LINEOUT1P) B7(IN1RN) B8(IN2LP/VRXN) B9(IN2LN/DMICDAT1) C3(SPKOUTRN) C4(LINEOUT2N) C5(LINEOUT1N) C7(IN1RP) C8(IN1LP) E1(GPIO2/MCLK2) E5(GPIO7/ADCDAT2) F4(GPIO4/LRCLK2) F5(GPIO9/ADCDAT3) F6(GPIO11/BCLK3) F8(HPOUT2P) F9(HPOUT2N) G4(GPIO6/ADCLRCLK2) H2(GPIO3/BCLK2) H3(GPIO5/DACDAT2) H4(GPIO8/DACDAT3) H5(GPIO10/LRCLK3)

### Notes on the sheet
- Default I2C Address:0011010
- PB9
- PB8
- PC7
- PA2
- (near R193) PG9
- PE6
- To MFX
- (near R193) PA0
- (near R193) PC1
- (near R193) MFX_GPIO5
- RIGHT
- (near U25) LEFT
- (near JP18) PD6
- (near C64) time slot0 of SAI
- (near JP18) time slot1 of SAI
- MICBIAS1
- LEFT
- SPDIF connector
- (near R215) PG12
- (near C96) Close to connector
- Less than 7mm
- Title:
- Project:
- Size:
- Date:
- A4
- Reference:
- Sheet:
- Revision:
- of

### Library data of the parts
C63 C65 C66 C68 C72 C74 C76 C77 C83-C86 C89 C96 C101 = Cap: Capacitor; Value: 10nF; Published: 8-Jun-2000; Revision: July-2002: Re-released for DXP Platform.; Publisher: Altium Limited
C64 C67 C69 C71 C73 C75 C87 = CAP: Capacitor; Value: 100nF; Published: 8-Jun-2000; Revision: July-2002: Re-released for DXP Platform.; Publisher: Altium Limited
C88 C98 = Cap: Capacitor; Value: 10nF; Ordered by: Subcon; Published: 8-Jun-2000; Revision: July-2002: Re-released for DXP Platform.; Publisher: Altium Limited
C97 = CAP: Capacitor
CN24 CN27 = Coupon Connectors: Header, 3-Pin, Single row; Revision: 17-Jul-2002: Re-released for DXP Platform.; Publisher: Altium Limited
CN28 = OPTO
JP17-JP19 = Jumper3
R177-R179 R188 R189 R193-R195 R198 R199 R215 R223 = Res1: Resistor; Value: 1K; Published: 8-Jun-2000; Revision: July-2002: Re-released for DXP Platform.; Publisher: Altium Limited
R196 R220-R222 = Res1: Resistor; Value: 1K; Ordered by: Subcon; Published: 8-Jun-2000; Revision: July-2002: Re-released for DXP Platform.; Publisher: Altium Limited
R197 R219 = Res1: Resistor; Ordered by: Subcon; Published: 8-Jun-2000; Revision: July-2002: Re-released for DXP Platform.; Publisher: Altium Limited; Value: 1K
SB20 SB21 = Circuit Breaker_close: Circuit Breaker; Published: 24-Mar-1999; Revision: July-2002: Re-released for DXP Platform.; Publisher: Altium Limited
U24 U25 = MP34DT01TR: MEMS audio sensor; Revision: 17-Jul-2002: Re-released for DXP Platform.; Publisher: Altium Limited

## Sheet CAN&QSPI.SchDoc: CAN & QSPI
size A4; DocumentNumber: MB1167; Revision: B.1; SheetNumber: 11; SheetTotal: 17; Project: STM327x6G-EVAL
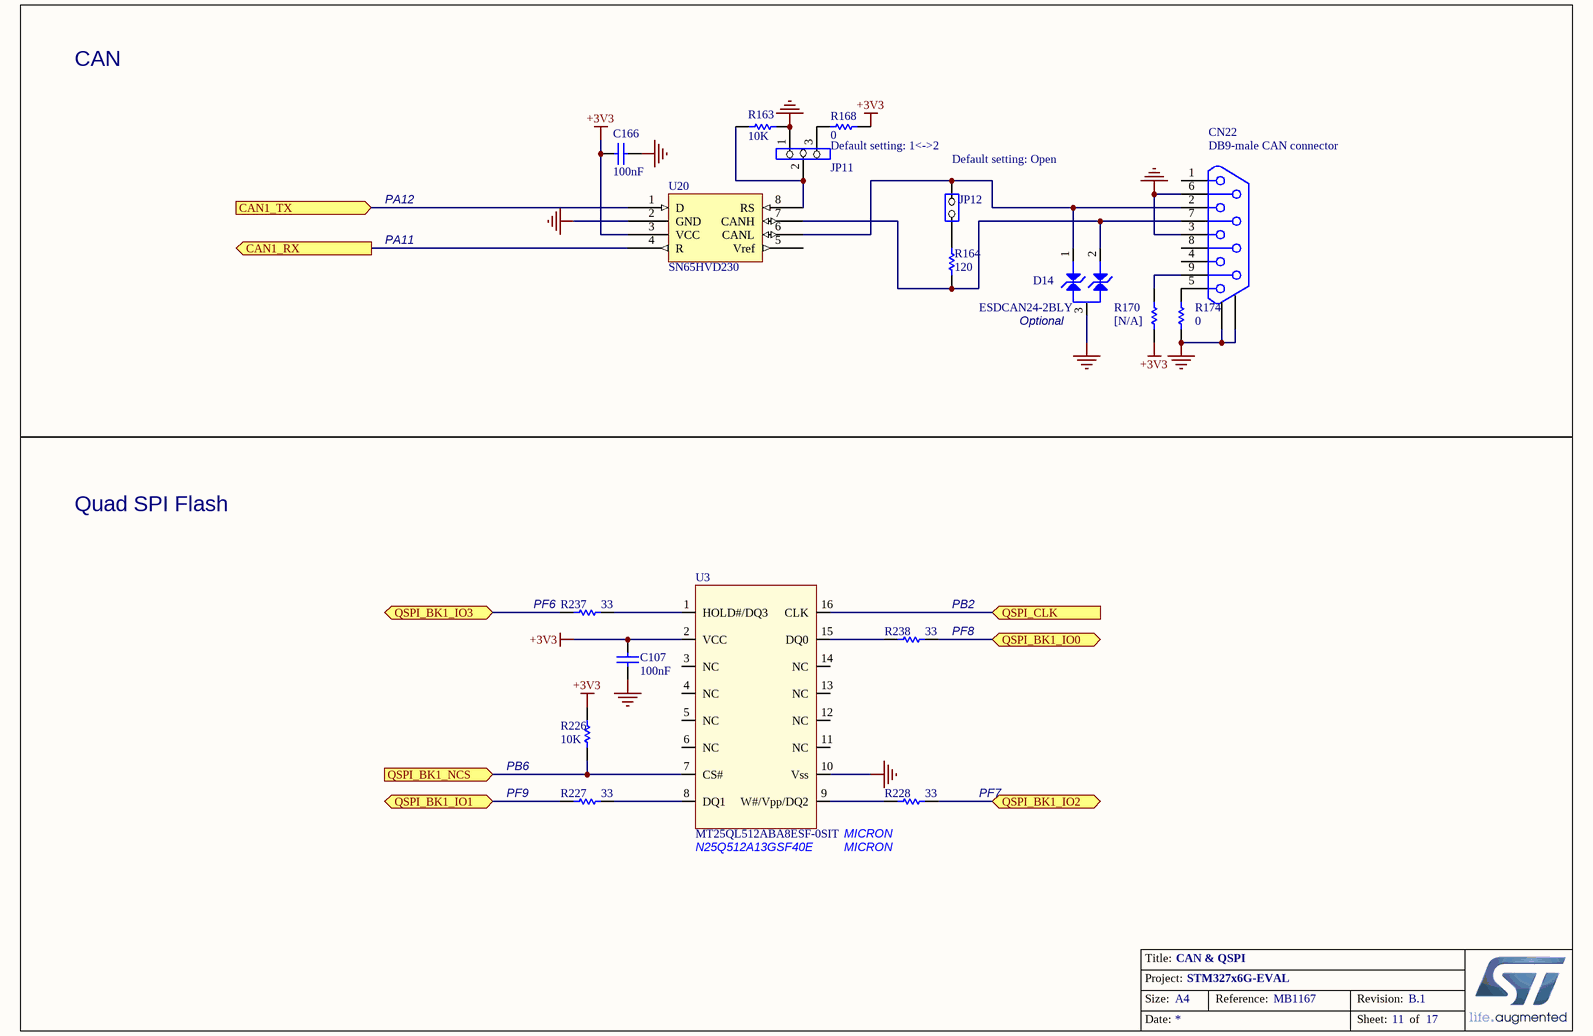
[diagram p2: CAN&QSPI.SchDoc]

### Parts
C107  100nF  [0402C]
C166  100nF  [0603C]
CN22  DB9-male CAN connector  [DB9/M]
D14  ESDCAN24-2BLY  [SOT-23]
JP11  (no value)  [SIP3]
JP12  (no value)  [SIP2]
R163  10K  [0603R]
R164  120  [0603R]
R168  0  [0603R]
R170  [N/A]  [0603R]
R174  0  [0603R]
R226  10K  [0402R]
R227  33  [0603R]
R228  33  [0603R]
R237  33  [0603R]
R238  33  [0603R]
U3  MT25QL512ABA8ESF-0SIT  [SOIC16W_1R27_10R3X10R33]
U20  SN65HVD230  [SOIC8_1R27_4R9X6]

### Ports
CAN1_RX (out), CAN1_TX (in), QSPI_BK1_IO0 (bidir), QSPI_BK1_IO1 (bidir), QSPI_BK1_IO2 (bidir), QSPI_BK1_IO3 (bidir), QSPI_BK1_NCS (in), QSPI_CLK (in)

### Nets
+3V3: C107.1 C166.1 R168.2 R170.1 R226.1 U3.2(VCC) U20.3(VCC)
GND: C107.2 C166.2 CN22.3 CN22.6 CN22.10 CN22.11 D14.3 JP11.1 R163.2 R174.1 U3.10(Vss) U20.2(GND)
PB2: U3.16(CLK) ; port QSPI_CLK
PB6: R226.2 U3.7(CS#) ; port QSPI_BK1_NCS
PF6: R237.2 ; port QSPI_BK1_IO3
PF7: R228.1 ; port QSPI_BK1_IO2
PF8: R238.1 ; port QSPI_BK1_IO0
PF9: R227.2 ; port QSPI_BK1_IO1
NetCN22_2: CN22.2 D14.1 JP12.2(NO) U20.6(CANL)
NetCN22_5: CN22.5 R174.2
NetCN22_7: CN22.7 D14.2 R164.1 U20.7(CANH)
NetCN22_9: CN22.9 R170.2
NetJP8_2: U20.4(R) ; port CAN1_RX
NetJP11_2: JP11.2 R163.1 U20.8(RS)
NetJP11_3: JP11.3 R168.1
NetJP12_1: JP12.1(COMMON) R164.2
NetR227_1: R227.1 U3.8(DQ1)
NetR228_2: R228.2 U3.9(W#/Vpp/DQ2)
NetR237_1: R237.1 U3.1(HOLD#/DQ3)
NetR238_2: R238.2 U3.15(DQ0)
NetSB49_1: U20.1(D) ; port CAN1_TX

Not connected (* = marked no-connect by the designer): CN22 1 4 8; U3 3(NC) 4(NC) 5(NC) 6(NC) 11(NC) 12(NC) 13(NC) 14(NC); U20 5(Vref)

### Notes on the sheet
- CAN
- Default setting: 1<->2
- (near JP12) Default setting: Open
- PA12
- PA11
- (near D14) Optional
- Quad SPI Flash
- (near R237) PF6
- (near R238) PF8
- (near R238) PB2
- PB6
- PF9
- (near U3) N25Q512A13GSF40E
- MICRON
- (near R228) PF7
- Title:
- Project:
- Size:
- Date:
- A4
- Reference:
- Sheet:
- Revision:
- of

### Library data of the parts
C107 = Cap: as C88 on sheet Audio; Published: 8-Jun-2000; Revision: July-2002: Re-released for DXP Platform.; Publisher: Altium Limited
C166 = Cap: Capacitor; Value: 10nF; Published: 8-Jun-2000; Revision: July-2002: Re-released for DXP Platform.; Publisher: Altium Limited
CN22 = DB9-CAN
JP11 = Jumper3
JP12 = JP2
R163 R227 R228 R237 R238 = Res1: Resistor; Value: 1K; Published: 8-Jun-2000; Revision: July-2002: Re-released for DXP Platform.; Publisher: Altium Limited
R164 R168 R170 R174 = res1: Resistor; Value: 1K; Published: 8-Jun-2000; Revision: July-2002: Re-released for DXP Platform.; Publisher: Altium Limited
R226 = res1: Resistor; Value: 1K; Ordered by: Subcon; Published: 8-Jun-2000; Revision: July-2002: Re-released for DXP Platform.; Publisher: Altium Limited
U3 = QSPI_16pins: ECCN_US/EU: 3A991
U20 = SN65HVD230D

## Sheet Ethernet.SchDoc: Ethernet
size A4; DocumentNumber: MB1167; Revision: B.1; SheetNumber: 7; SheetTotal: 17; Project: STM327x6G-EVAL
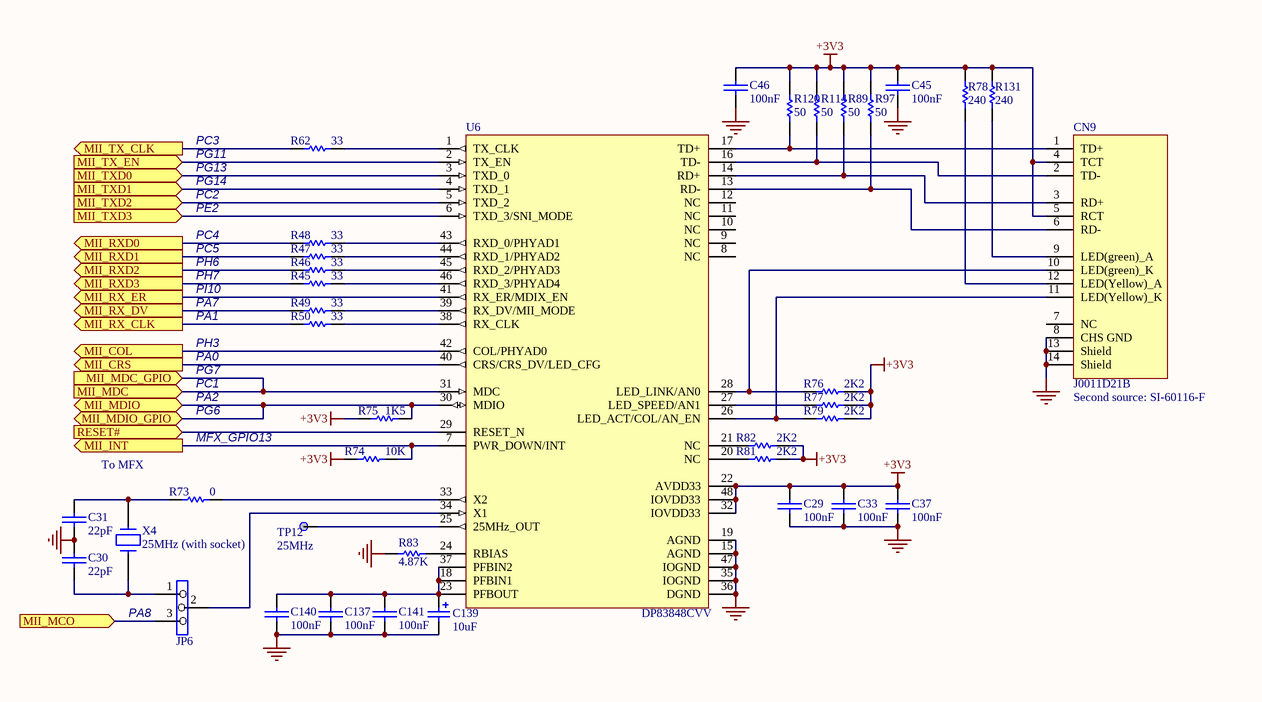
[diagram p3: Ethernet.SchDoc]

### Parts
C29  100nF  [0603C]
C30  22pF  [0603C]
C31  22pF  [0603C]
C33  100nF  [0603C]
C37  100nF  [0603C]
C45  100nF  [0603C]
C46  100nF  [0603C]
C137  100nF  [0603C]
C139  10uF  [TAN-A]
C140  100nF  [0603C]
C141  100nF  [0603C]
CN9  J0011D21B  [RJ45_J0011D01BNL]
JP6  (no value)  [SIP3]
R45  33  [0603R]
R46  33  [0603R]
R47  33  [0603R]
R48  33  [0603R]
R49  33  [0603R]
R50  33  [0603R]
R62  33  [0603R]
R73  0  [0603R]
R74  10K  [0603R]
R75  1K5  [0603R]
R76  2K2  [0603R]
R77  2K2  [0603R]
R78  240  [0603R]
R79  2K2  [0603R]
R81  2K2  [0603R]
R82  2K2  [0603R]
R83  4.87K  [0603R]
R89  50  [0603R]
R97  50  [0603R]
R114  50  [0603R]
R120  50  [0603R]
R131  240  [0603R]
TP12  25MHz  [TP]
U6  DP83848CVV  [LQFP48_0R5_9X9]
X4  25MHz (with socket)  [XTAL_socket]

### Ports
MII_COL (out), MII_CRS (out), MII_INT (out), MII_MCO (in), MII_MDC (in), MII_MDC_GPIO (in), MII_MDIO (bidir), MII_MDIO_GPIO (bidir), MII_RX_CLK (out), MII_RX_DV (out), MII_RX_ER (out), MII_RXD0 (out), MII_RXD1 (out), MII_RXD2 (out), MII_RXD3 (out), MII_TX_CLK (out), MII_TX_EN (in), MII_TXD0 (in), MII_TXD1 (in), MII_TXD2 (in), MII_TXD3 (in), RESET# (in)

### Nets
+3V3: C29.1 C33.2 C37.2 C45.2 C46.2 CN9.4(TCT) CN9.5(RCT) R74.1 R75.2 R76.2 R77.2 R78.2 R79.2 R81.2 R82.2 R89.1 R97.1 R114.1 R120.1 R131.2 U6.22(AVDD33) U6.32(IOVDD33) U6.48(IOVDD33)
GND: C29.2 C30.2 C31.1 C33.1 C37.1 C45.1 C46.1 C137.1 C139.2 C140.2 C141.1 CN9.8(CHS_GND) CN9.13(Shield) CN9.14(Shield) R83.1 U6.15(AGND) U6.19(AGND) U6.35(IOGND) U6.36(DGND) U6.47(IOGND)
PH7: R45.2 ; port MII_RXD3
RESET#: U6.29(RESET_N) ; port RESET#
NetC30_1: C30.1 JP6.1 X4.1
NetC31_2: C31.2 R73.2 X4.2
NetC137_2: C137.2 C139.1 C140.1 C141.2 U6.18(PFBIN1) U6.23(PFBOUT) U6.37(PFBIN2)
NetCN9_1: CN9.1(TD+) R120.2 U6.17(TD+)
NetCN9_2: CN9.2(TD-) R114.2 U6.16(TD-)
NetCN9_3: CN9.3(RD+) R89.2 U6.14(RD+)
NetCN9_6: CN9.6(RD-) R97.2 U6.13(RD-)
NetCN9_9: CN9.9(LED(green)_A) R131.1
NetCN9_10: CN9.10(LED(green)_K) R76.1 U6.28(LED_LINK/AN0)
NetCN9_11: CN9.11(LED(Yellow)_K) R79.1 U6.26(LED_ACT/COL/AN_EN)
NetCN9_12: CN9.12(LED(Yellow)_A) R78.1
NetJP6_2: JP6.2 U6.34(X1)
NetJP6_3: JP6.3 ; port MII_MCO
NetJP21_3: R75.1 U6.30(MDIO) ; port MII_MDIO, port MII_MDIO_GPIO
NetJP22_3: U6.31(MDC) ; port MII_MDC, port MII_MDC_GPIO
NetR45_1: R45.1 U6.46(RXD_3/PHYAD4)
NetR46_1: R46.1 U6.45(RXD_2/PHYAD3)
NetR46_2: R46.2 ; port MII_RXD2
NetR47_1: R47.1 U6.44(RXD_1/PHYAD2)
NetR47_2: R47.2 ; port MII_RXD1
NetR48_1: R48.1 U6.43(RXD_0/PHYAD1)
NetR48_2: R48.2 ; port MII_RXD0
NetR49_1: R49.1 U6.39(RX_DV/MII_MODE)
NetR49_2: R49.2 ; port MII_RX_DV
NetR50_1: R50.1 U6.38(RX_CLK)
NetR50_2: R50.2 ; port MII_RX_CLK
NetR62_1: R62.1 U6.1(TX_CLK)
NetR62_2: R62.2 ; port MII_TX_CLK
NetR73_1: R73.1 U6.33(X2)
NetR74_2: R74.2 U6.7(PWR_DOWN/INT) ; port MII_INT
NetR77_1: R77.1 U6.27(LED_SPEED/AN1)
NetR81_1: R81.1 U6.20(NC)
NetR82_1: R82.1 U6.21(NC)
NetR83_2: R83.2 U6.24(RBIAS)
NetR241_2: U6.5(TXD_2) ; port MII_TXD2
NetR243_2: U6.3(TXD_0) ; port MII_TXD0
NetR244_2: U6.4(TXD_1) ; port MII_TXD1
NetR247_1: U6.6(TXD_3/SNI_MODE) ; port MII_TXD3
NetR252_2: U6.2(TX_EN) ; port MII_TX_EN
NetSB9_2: U6.41(RX_ER/MDIX_EN) ; port MII_RX_ER
NetSB36_1: U6.40(CRS/CRS_DV/LED_CFG) ; port MII_CRS
NetSB47_2: U6.42(COL/PHYAD0) ; port MII_COL
NetTP12_1: TP12.1 U6.25(25MHz_OUT)

Not connected (* = marked no-connect by the designer): CN9 7(NC); U6 8(NC) 9(NC) 10(NC) 11(NC) 12(NC)

### Notes on the sheet
- PC3
- PG11
- PG13
- PG14
- PC2
- PE2
- PC4
- PC5
- PH6
- PH7
- PI10
- PA7
- PH3
- PA1
- PA0
- PC1
- PA2
- PG7
- PG6
- (near CN9) Second source: SI-60116-F
- To MFX
- MFX_GPIO13
- (near JP6) PA8
- Title:
- Project:
- Size:
- Date:
- A4
- Reference:
- Sheet:
- Revision:
- of

### Library data of the parts
C29-C31 C33 C37 C45 C46 C137 C140 C141 = CAP: Capacitor
C139 = Cap Pol1: Polarized Capacitor (Radial); Published: 8-Jun-2000; Revision: July-2002: Re-released for DXP Platform.; Publisher: Altium Limited; Value: 10uF
JP6 = Jumper3
R45-R50 R62 R73-R79 R81-R83 R89 R97 R114 R120 R131 = Res1: Resistor; Value: 1K; Published: 8-Jun-2000; Revision: July-2002: Re-released for DXP Platform.; Publisher: Altium Limited
TP12 = TP
X4 = CRYSTAL

## Sheet ExtensionConnector.SchDoc: Extension Connectors
size A4; DocumentNumber: MB1167; Revision: B.1; SheetNumber: 14; SheetTotal: 17; Project: STM327x6G-EVAL
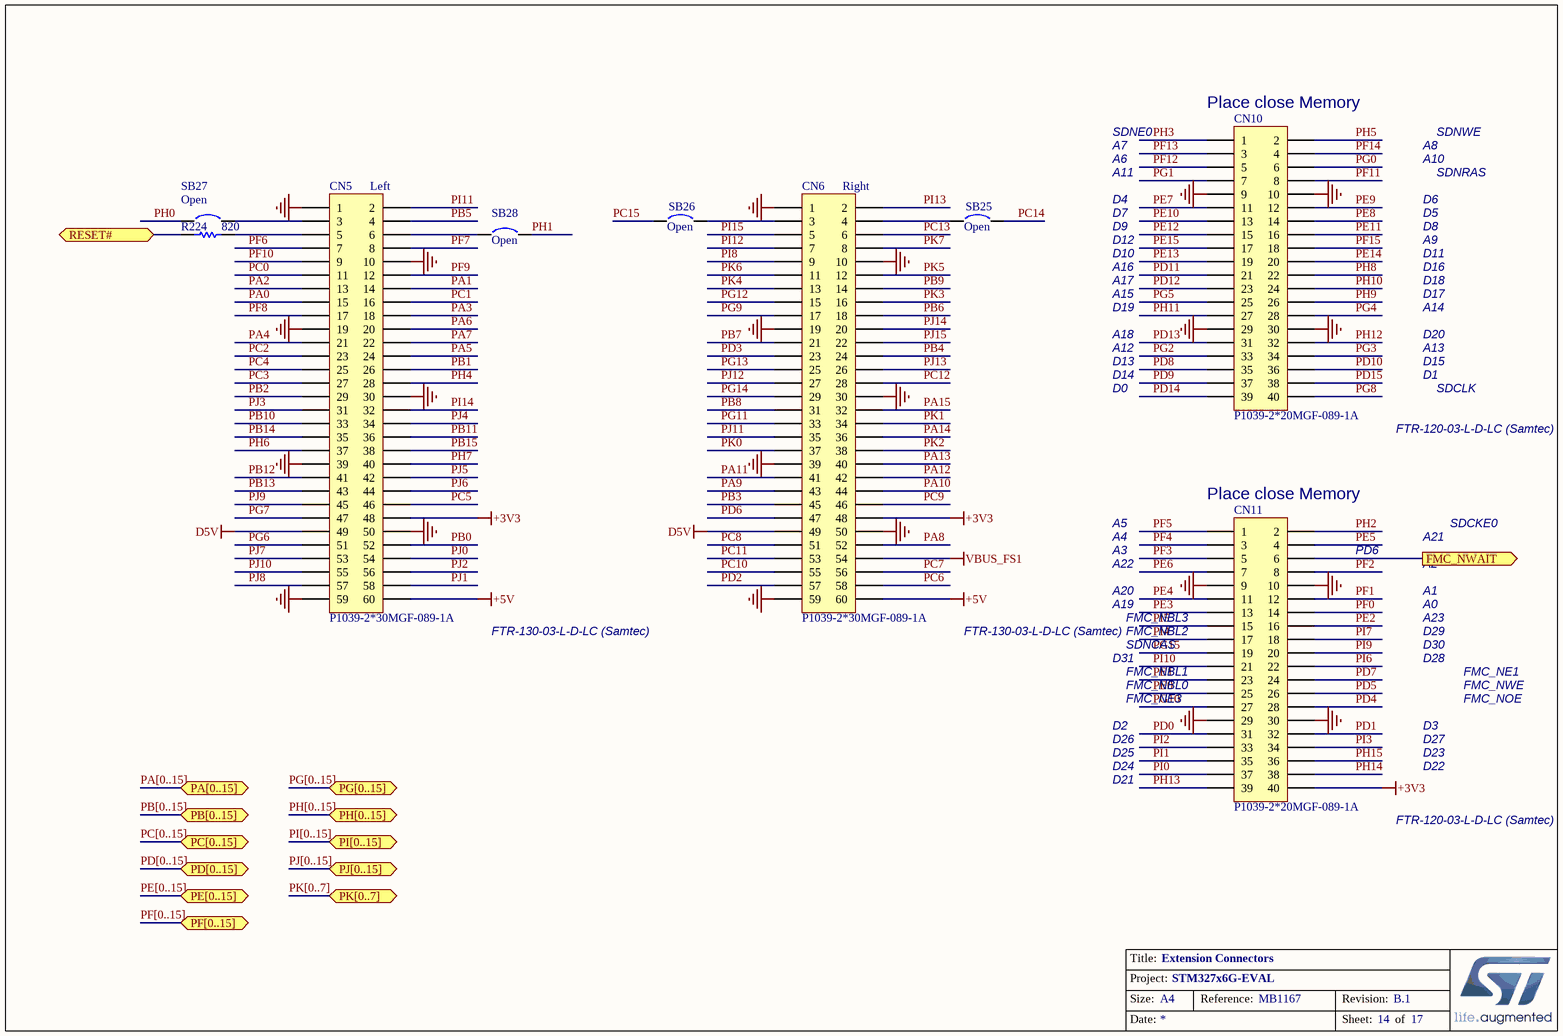
[diagram p4: ExtensionConnector.SchDoc]

### Parts
CN5  P1039-2*30MGF-089-1A  [FTR-130-53-L-D-LC]
CN6  P1039-2*30MGF-089-1A  [FTR-130-53-L-D-LC]
CN10  P1039-2*20MGF-089-1A  [FTR-120-53-L-D-LC]
CN11  P1039-2*20MGF-089-1A  [FTR-120-53-L-D-LC]
R224  820  [0603R]
SB25  Open  [SB_0603]
SB26  Open  [SB_0603]
SB27  Open  [SB_0603]
SB28  Open  [SB_0603]

### Ports
FMC_NWAIT (out), PA[0..15] (bidir), PB[0..15] (bidir), PC[0..15] (bidir), PD[0..15] (bidir), PE[0..15] (bidir), PF[0..15] (bidir), PG[0..15] (bidir), PH[0..15] (bidir), PI[0..15] (bidir), PJ[0..15] (bidir), PK[0..7] (bidir), RESET# (bidir)

### Nets
+3V3: CN5.48 CN6.48 CN11.40
+5V: CN5.60 CN6.60
D5V: CN5.49 CN6.49
GND: CN5.1 CN5.10 CN5.19 CN5.30 CN5.39 CN5.50 CN5.59 CN6.1 CN6.10 CN6.19 CN6.30 CN6.39 CN6.50 CN6.59 CN10.9 CN10.10 CN10.29 CN10.30 CN11.9 CN11.10 CN11.29 CN11.30
VBUS_FS1: CN6.54
PA0: CN5.15
PA1: CN5.14
PA2: CN5.13
PA3: CN5.18
PA4: CN5.21
PA5: CN5.24
PA6: CN5.20
PA7: CN5.22
PA8: CN6.52
PA9: CN6.43
PA10: CN6.44
PA11: CN6.41
PA12: CN6.42
PA13: CN6.40
PA14: CN6.36
PA15: CN6.32
PB0: CN5.52
PB1: CN5.26
PB2: CN5.29
PB3: CN6.45
PB4: CN6.24
PB5: CN5.4
PB6: CN6.18
PB7: CN6.21
PB8: CN6.31  [project net I2C1_SCL]
PB9: CN6.14  [project net I2C1_SDA]
PB10: CN5.33
PB11: CN5.36
PB12: CN5.41
PB13: CN5.43
PB14: CN5.35
PB15: CN5.38
PC0: CN5.11
PC1: CN5.16
PC2: CN5.23
PC3: CN5.27
PC4: CN5.25
PC5: CN5.46
PC6: CN6.58  [project net I2S3_CK]
PC7: CN6.56  [project net PAR_D1]
PC8: CN6.51  [project net PAR_D2]
PC9: CN6.46  [project net PAR_D3]
PC10: CN6.55  [project net PAR_D8]
PC11: CN6.53  [project net PAR_D4]
PC12: CN6.28  [project net PAR_D9]
PC13: CN6.6
PC14: SB25.1
PC15: SB26.1
PD0: CN11.31  [project net D2]
PD1: CN11.32  [project net D3]
PD2: CN6.57  [project net PAR_D11]
PD3: CN6.23  [project net PAR_D5]
PD4: CN11.28
PD5: CN11.26
PD6: CN6.47  [project net PAR_D10]
PD7: CN11.24
PD8: CN10.35  [project net D13]
PD9: CN10.37  [project net D14]
PD10: CN10.36  [project net D15]
PD11: CN10.21  [project net A16]
PD12: CN10.23  [project net A17]
PD13: CN10.31  [project net A18]
PD14: CN10.39  [project net D0]
PD15: CN10.38  [project net D1]
PE0: CN11.25
PE1: CN11.23
PE2: CN11.16  [project net A23]
PE3: CN11.13  [project net A19]
PE4: CN11.11  [project net A20]
PE5: CN11.4  [project net A21]
PE6: CN11.7  [project net A22]
PE7: CN10.11  [project net D4]
PE8: CN10.14  [project net D5]
PE9: CN10.12  [project net D6]
PE10: CN10.13  [project net D7]
PE11: CN10.16  [project net D8]
PE12: CN10.15  [project net D9]
PE13: CN10.19  [project net D10]
PE14: CN10.20  [project net D11]
PE15: CN10.17  [project net D12]
PF0: CN11.14  [project net A0]
PF1: CN11.12  [project net A1]
PF2: CN11.8  [project net A2]
PF3: CN11.5  [project net A3]
PF4: CN11.3  [project net A4]
PF5: CN11.1  [project net A5]
PF6: CN5.7
PF7: CN5.8
PF8: CN5.17
PF9: CN5.12
PF10: CN5.9
PF11: CN10.8
PF12: CN10.5  [project net A6]
PF13: CN10.3  [project net A7]
PF14: CN10.4  [project net A8]
PF15: CN10.18  [project net A9]
PG0: CN10.6  [project net A10]
PG1: CN10.7  [project net A11]
PG2: CN10.33  [project net A12]
PG3: CN10.34  [project net A13]
PG4: CN10.28  [project net A14]
PG5: CN10.25  [project net A15]
PG6: CN5.51
PG7: CN5.47
PG8: CN10.40
PG9: CN6.17
PG10: CN11.27
PG11: CN6.33
PG12: CN6.15
PG13: CN6.25
PG14: CN6.29
PG15: CN11.19
PH0: SB27.1
PH1: SB28.1
PH2: CN11.2
PH3: CN10.1
PH4: CN5.28
PH5: CN10.2
PH6: CN5.37
PH7: CN5.40
PH8: CN10.22  [project net D16]
PH9: CN10.26  [project net D17]
PH10: CN10.24  [project net D18]
PH11: CN10.27  [project net D19]
PH12: CN10.32  [project net D20]
PH13: CN11.39  [project net D21]
PH14: CN11.38  [project net D22]
PH15: CN11.36  [project net D23]
PI0: CN11.37  [project net D24]
PI1: CN11.35  [project net D25]
PI2: CN11.33  [project net D26]
PI3: CN11.34  [project net D27]
PI4: CN11.17
PI5: CN11.15
PI6: CN11.22  [project net D28]
PI7: CN11.18  [project net D29]
PI8: CN6.9
PI9: CN11.20  [project net D30]
PI10: CN11.21  [project net D31]
PI11: CN5.2
PI12: CN6.7
PI13: CN6.2
PI14: CN5.32
PI15: CN6.5  [project net LCD_R0]
PJ0: CN5.54  [project net LCD_R1]
PJ1: CN5.58  [project net LCD_R2]
PJ2: CN5.56  [project net LCD_R3]
PJ3: CN5.31  [project net LCD_R4]
PJ4: CN5.34  [project net LCD_R5]
PJ5: CN5.42  [project net LCD_R6]
PJ6: CN5.44  [project net LCD_R7]
PJ7: CN5.53  [project net LCD_G0]
PJ8: CN5.57  [project net LCD_G1]
PJ9: CN5.45  [project net LCD_G2]
PJ10: CN5.55  [project net LCD_G3]
PJ11: CN6.35  [project net LCD_G4]
PJ12: CN6.27  [project net LCD_B0]
PJ13: CN6.26  [project net LCD_B1]
PJ14: CN6.20  [project net LCD_B2]
PJ15: CN6.22  [project net LCD_B3]
PK0: CN6.37  [project net LCD_G5]
PK1: CN6.34  [project net LCD_G6]
PK2: CN6.38  [project net LCD_G7]
PK3: CN6.16  [project net LCD_B4]
PK4: CN6.13  [project net LCD_B5]
PK5: CN6.12  [project net LCD_B6]
PK6: CN6.11  [project net LCD_B7]
PK7: CN6.8
RESET#: R224.1 ; port RESET#
NetCN5_3: CN5.3 SB27.2
NetCN5_5: CN5.5 R224.2
NetCN5_6: CN5.6 SB28.2
NetCN6_3: CN6.3 SB26.2
NetCN6_4: CN6.4 SB25.2
NetCN11_6: CN11.6 ; port FMC_NWAIT

### Buses and harness runs
bus PA[0..15] = port PA[0..15]
bus PB[0..15] = port PB[0..15]
bus PC[0..15] = port PC[0..15]
bus PD[0..15] = port PD[0..15]
bus PE[0..15] = port PE[0..15]
bus PF[0..15] = port PF[0..15]
bus PG[0..15] = port PG[0..15]
bus PH[0..15] = port PH[0..15]
bus PI[0..15] = port PI[0..15]
bus PJ[0..15] = port PJ[0..15]
bus PK[0..7] = port PK[0..7]

### Notes on the sheet
- (near CN10) Place close Memory
- A6
- A7
- A11
- SDNE0
- A8
- A10
- SDNRAS
- SDNWE
- (near CN5) Left
- (near CN6) Right
- D4
- D7
- D9
- D12
- D5
- D6
- D8
- A9
- A16
- A17
- D10
- A15
- D19
- D11
- A14
- D16
- D17
- D18
- D13
- D14
- A18
- A12
- D15
- D1
- A13
- D20
- D0
- (near CN10) FTR-120-03-L-D-LC (Samtec)
- SDCLK
- (near CN11) Place close Memory
- A22
- A3
- A4
- A5
- PD6
- A21
- A2
- SDCKE0
- (near CN5) FTR-130-03-L-D-LC (Samtec)
- (near CN6) FTR-130-03-L-D-LC (Samtec)
- A19
- A20
- SDNCAS
- FMC_NBL2
- FMC_NBL3
- A23
- A0
- A1
- D29
- D30
- D31
- FMC_NBL0
- FMC_NBL1
- FMC_NE3
- D28
- FMC_NOE
- FMC_NWE
- FMC_NE1
- D2
- D21
- D24
- D25
- D26
- D3
- D22
- D23
- D27
- (near CN11) FTR-120-03-L-D-LC (Samtec)
- Title:
- Project:
- Size:
- Date:
- Reference:
- Sheet:
- Revision:
- of

### Library data of the parts
CN5 CN6 = FTR-130-53-L-D-LC: Header, 40-Pin, Dual row; Revision: 17-Jul-2002: Re-released for DXP Platform.; Publisher: Altium Limited
CN10 CN11 = FTR-120-53-L-D-LC: Header, 20-Pin, Dual row; Revision: 17-Jul-2002: Re-released for DXP Platform.; Publisher: Altium Limited
R224 = res1: Resistor; Value: 1K; Published: 8-Jun-2000; Revision: July-2002: Re-released for DXP Platform.; Publisher: Altium Limited
SB25-SB28 = Circuit Breaker: Published: 24-Mar-1999; Revision: July-2002: Re-released for DXP Platform.; Publisher: Altium Limited

## Sheet JTAG&Trace.SchDoc: JTAG & Trace
size A4; DocumentNumber: MB1167; Revision: B.1; SheetNumber: 17; SheetTotal: 17; Project: STM327x6G-EVAL
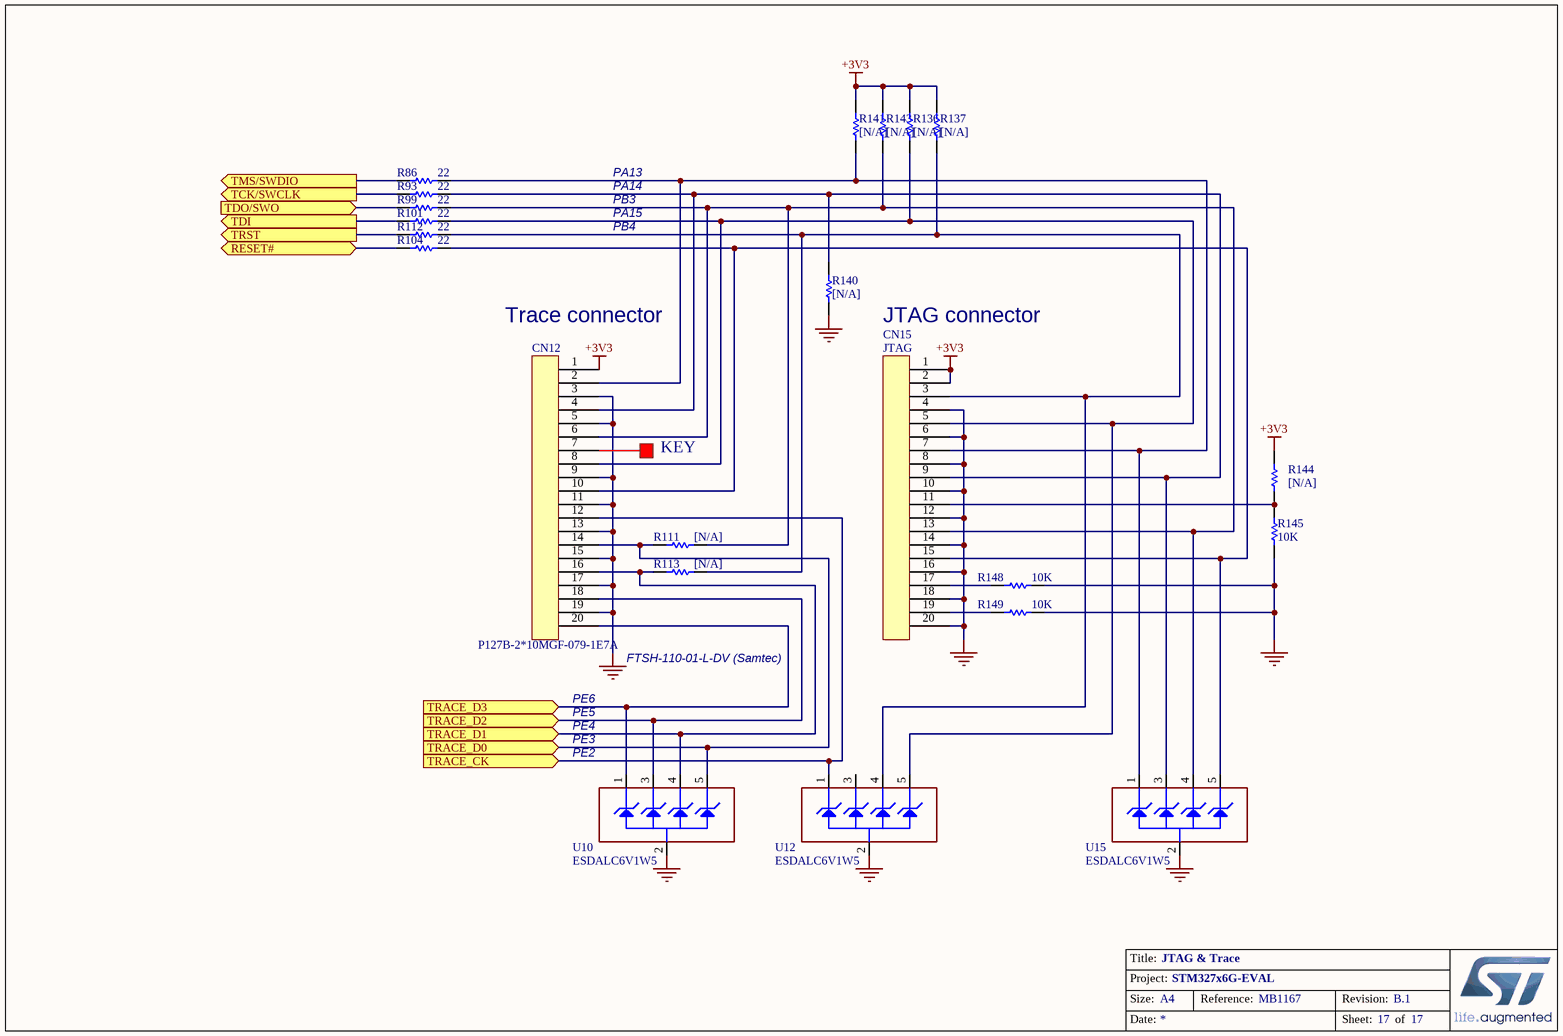
[diagram p5: JTAG&Trace.SchDoc]

### Parts
CN12  P127B-2*10MGF-079-1E7A  [FTSH-110-01-L-DV]
CN15  JTAG  [IDC20S]
R86  22  [0603R]
R93  22  [0603R]
R99  22  [0603R]
R101  22  [0603R]
R104  22  [0603R]
R111  [N/A]  [0603R]
R112  22  [0603R]
R113  [N/A]  [0603R]
R136  [N/A]  [0603R]
R137  [N/A]  [0603R]
R140  [N/A]  [0603R]
R141  [N/A]  [0603R]
R143  [N/A]  [0603R]
R144  [N/A]  [0603R]
R145  10K  [0603R]
R148  10K  [0603R]
R149  10K  [0603R]
U10  ESDALC6V1W5  [SOT-353]
U12  ESDALC6V1W5  [SOT-353]
U15  ESDALC6V1W5  [SOT-353]

### Ports
RESET# (bidir), TCK/SWCLK (out), TDI (out), TDO/SWO (in), TMS/SWDIO (out), TRACE_CK (in), TRACE_D0 (in), TRACE_D1 (in), TRACE_D2 (in), TRACE_D3 (in), TRST (out)

### Nets
+3V3: CN12.1 CN15.1 CN15.2 R136.2 R137.2 R141.2 R143.2 R144.2
GND: CN12.3 CN12.5 CN12.9 CN12.11 CN12.13 CN12.15 CN12.17 CN12.19 CN15.4 CN15.6 CN15.8 CN15.10 CN15.12 CN15.14 CN15.16 CN15.18 CN15.20 R140.1 R145.1 R148.1 R149.1 U10.2(GND) U12.2(GND) U15.2(GND)
PA13: R86.2 ; port TMS/SWDIO
PA14: R93.2 ; port TCK/SWCLK
PA15: R101.2 ; port TDI
PB4: R112.2 ; port TRST
RESET#: R104.2 ; port RESET#
T_JTDO: R99.2 ; port TDO/SWO
NetCN12_2: CN12.2 CN15.7 R86.1 R141.1 U15.1(IO1)
NetCN12_4: CN12.4 CN15.9 R93.1 R140.2 U15.3(IO2)
NetCN12_6: CN12.6 CN15.13 R99.1 R111.2 R143.1 U15.4(IO3)
NetCN12_8: CN12.8 CN15.5 R101.1 R136.1 U12.5(IO4)
NetCN12_10: CN12.10 CN15.15 R104.1 U15.5(IO4)
NetCN12_12: CN12.12 U12.1(IO1) ; port TRACE_CK
NetCN12_14: CN12.14 R111.1 U10.5(IO4) ; port TRACE_D0
NetCN12_16: CN12.16 R113.1 U10.4(IO3) ; port TRACE_D1
NetCN12_18: CN12.18 U10.3(IO2) ; port TRACE_D2
NetCN12_20: CN12.20 U10.1(IO1) ; port TRACE_D3
NetCN15_3: CN15.3 R112.1 R113.2 R137.1 U12.4(IO3)
NetCN15_11: CN15.11 R144.1 R145.2
NetCN15_17: CN15.17 R148.2
NetCN15_19: CN15.19 R149.2

Not connected (* = marked no-connect by the designer): CN12 7; U12 3(IO2)

### Notes on the sheet
- PA13
- PA14
- PB3
- PA15
- PB4
- (near CN12) Trace connector
- JTAG connector
- KEY
- PE6
- PE5
- (near CN12) FTSH-110-01-L-DV (Samtec)
- PE4
- PE3
- (near U10) PE2
- Title:
- Project:
- Size:
- Date:
- A4
- Reference:
- Sheet:
- Revision:
- of

### Library data of the parts
CN12 CN15 = 20PIN1
R86 R93 R99 R101 R104 R111-R113 R136 R137 R140 R141 R143-R145 R148 R149 = Res1: Resistor; Value: 1K; Published: 8-Jun-2000; Revision: July-2002: Re-released for DXP Platform.; Publisher: Altium Limited
U10 U12 U15 = ESDALC6V1W5: Dual Transil array for ESD protection; Manuf_1: STM; Manuf_Part_1: ESDA5V3L; Ref St: 9179034; Provided: ST; ECCN_US/EU: EAR99/NEC; Distrib: ST; Order: ESDA5V3L; Ordered by: STM

## Sheet Memory.SchDoc: SRAM & FLASH & SDRAM
size A4; DocumentNumber: MB1167; Revision: B.1; SheetNumber: 4; SheetTotal: 17; Project: STM327x6G-EVAL
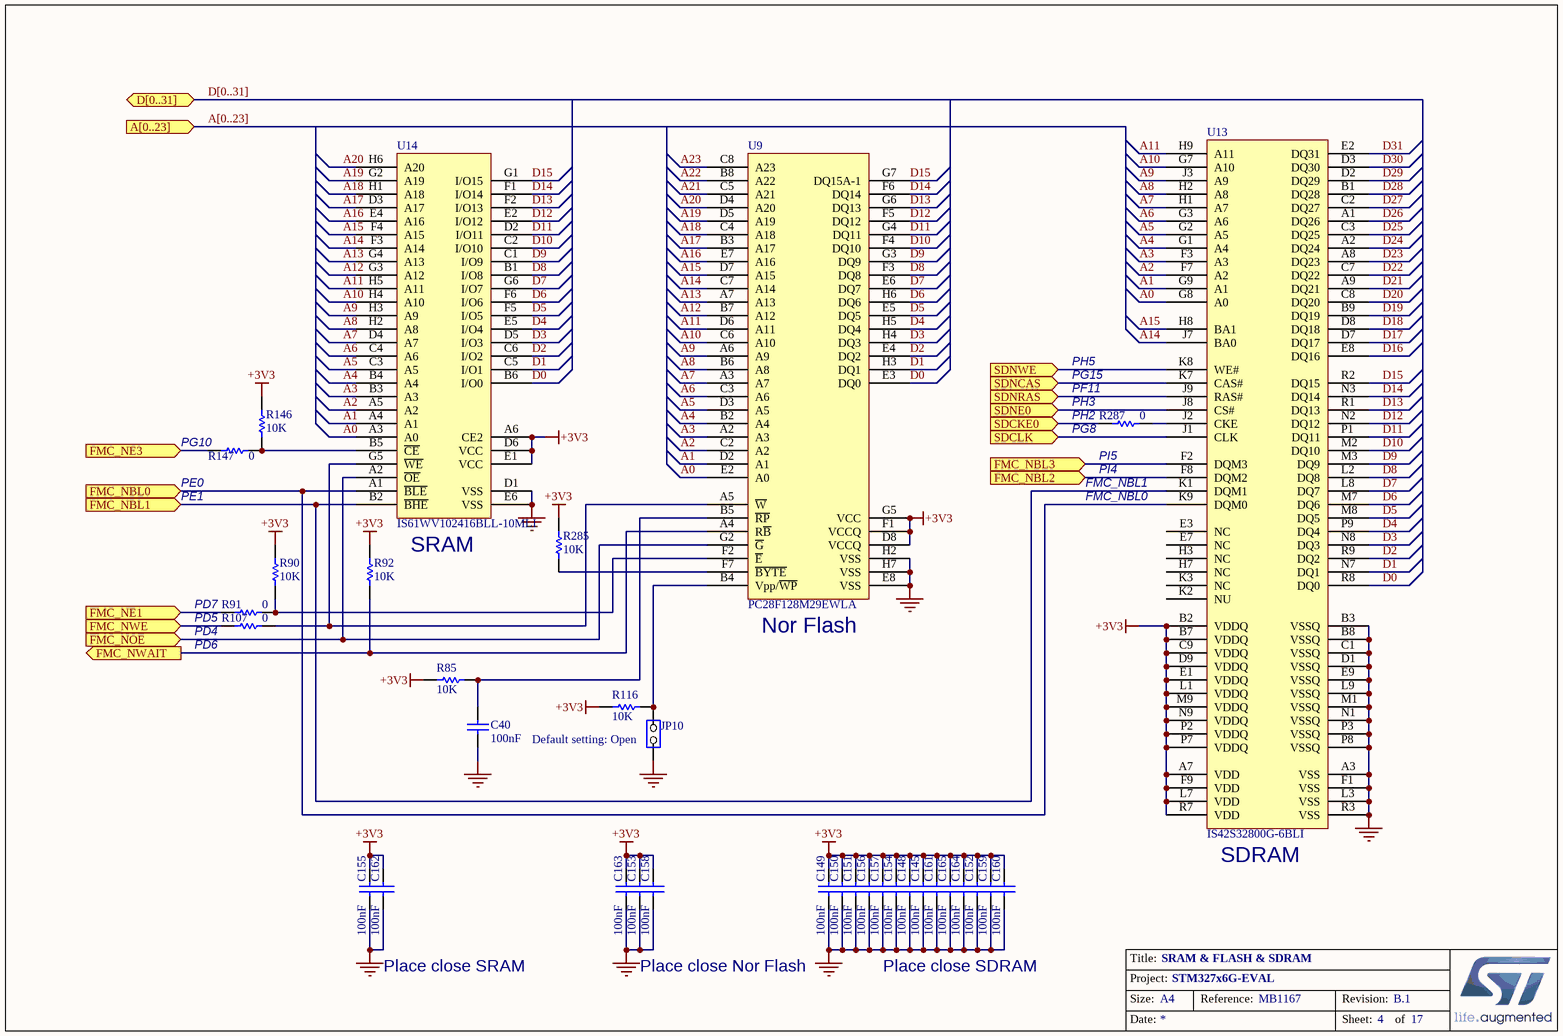
[diagram p6: Memory.SchDoc]

### Parts
C40  100nF  [0603C]
C145  100nF  [0603C]
C148  100nF  [0603C]
C149  100nF  [0603C]
C150  100nF  [0603C]
C151  100nF  [0603C]
C152  100nF  [0603C]
C153  100nF  [0603C]
C154  100nF  [0603C]
C155  100nF  [0603C]
C156  100nF  [0603C]
C157  100nF  [0603C]
C158  100nF  [0603C]
C159  100nF  [0603C]
C160  100nF  [0603C]
C161  100nF  [0603C]
C162  100nF  [0603C]
C163  100nF  [0603C]
C164  100nF  [0603C]
C165  100nF  [0603C]
JP10  (no value)  [SIP2]
R85  10K  [0603R]
R90  10K  [0603R]
R91  0  [0603R]
R92  10K  [0603R]
R107  0  [0603R]
R116  10K  [0603R]
R146  10K  [0603R]
R147  0  [0603R]
R285  10K  [0603R]
R287  0  [0603R]
U9  PC28F128M29EWLA  [FBGA64_1_11X13]
U13  IS42S32800G-6BLI  [FBGA90_0R8_8X13]
U14  IS61WV102416BLL-10MLI  [BGA48_0R75_9X11]

### Ports
A[0..23] (in), D[0..31] (bidir), FMC_NBL0 (in), FMC_NBL1 (in), FMC_NBL2 (in), FMC_NBL3 (in), FMC_NE1 (in), FMC_NE3 (in), FMC_NOE (in), FMC_NWAIT (out), FMC_NWE (in), SDCKE0 (in), SDCLK (in), SDNCAS (in), SDNE0 (in), SDNRAS (in), SDNWE (in)

### Nets
+3V3: C145.1 C148.1 C149.1 C150.1 C151.1 C152.1 C153.1 C154.1 C155.1 C156.1 C157.1 C158.1 C159.1 C160.1 C161.1 C162.1 C163.1 C164.1 C165.1 R85.1 R90.2 R92.2 R116.2 R146.2 R285.2 U9.D8(VCCQ) U9.F1(VCCQ) U9.G5(VCC) U13.A7(VDD) U13.B2(VDDQ) U13.B7(VDDQ) U13.C9(VDDQ) U13.D9(VDDQ) U13.E1(VDDQ) U13.F9(VDD) U13.L1(VDDQ) U13.L7(VDD) U13.M9(VDDQ) U13.N9(VDDQ) U13.P2(VDDQ) U13.P7(VDDQ) U13.R7(VDD) U14.A6(CE2) U14.D6(VCC) U14.E1(VCC)
GND: C40.2 C145.2 C148.2 C149.2 C150.2 C151.2 C152.2 C153.2 C154.2 C155.2 C156.2 C157.2 C158.2 C159.2 C160.2 C161.2 C162.2 C163.2 C164.2 C165.2 JP10.1(COMMON) U9.E8(VSS) U9.H2(VSS) U9.H7(VSS) U13.A3(VSS) U13.B3(VSSQ) U13.B8(VSSQ) U13.C1(VSSQ) U13.D1(VSSQ) U13.E9(VSSQ) U13.F1(VSS) U13.L3(VSS) U13.L9(VSSQ) U13.M1(VSSQ) U13.N1(VSSQ) U13.P3(VSSQ) U13.P8(VSSQ) U13.R3(VSS) U14.D1(VSS) U14.E6(VSS)
A0: U9.E2(A0) U13.G8(A0) U14.A3(A0)
A1: U9.D2(A1) U13.G9(A1) U14.A4(A1)
A2: U9.C2(A2) U13.F7(A2) U14.A5(A2)
A3: U9.A2(A3) U13.F3(A3) U14.B3(A3)
A4: U9.B2(A4) U13.G1(A4) U14.B4(A4)
A5: U9.D3(A5) U13.G2(A5) U14.C3(A5)
A6: U9.C3(A6) U13.G3(A6) U14.C4(A6)
A7: U9.A3(A7) U13.H1(A7) U14.D4(A7)
A8: U9.B6(A8) U13.H2(A8) U14.H2(A8)
A9: U9.A6(A9) U13.J3(A9) U14.H3(A9)
A10: U9.C6(A10) U13.G7(A10) U14.H4(A10)
A11: U9.D6(A11) U13.H9(A11) U14.H5(A11)
A12: U9.B7(A12) U14.G3(A12)
A13: U9.A7(A13) U14.G4(A13)
A14: U9.C7(A14) U13.J7(BA0) U14.F3(A14)
A15: U9.D7(A15) U13.H8(BA1) U14.F4(A15)
A16: U9.E7(A16) U14.E4(A16)
A17: U9.B3(A17) U14.D3(A17)
A18: U9.C4(A18) U14.H1(A18)
A19: U9.D5(A19) U14.G2(A19)
A20: U9.D4(A20) U14.H6(A20)
A21: U9.C5(A21)
A22: U9.B8(A22)
A23: U9.C8(A23)
D0: U9.E3(DQ0) U13.R8(DQ0) U14.B6(I/O0)
D1: U9.H3(DQ1) U13.N7(DQ1) U14.C5(I/O1)
D2: U9.E4(DQ2) U13.R9(DQ2) U14.C6(I/O2)
D3: U9.H4(DQ3) U13.N8(DQ3) U14.D5(I/O3)
D4: U9.H5(DQ4) U13.P9(DQ4) U14.E5(I/O4)
D5: U9.E5(DQ5) U13.M8(DQ5) U14.F5(I/O5)
D6: U9.H6(DQ6) U13.M7(DQ6) U14.F6(I/O6)
D7: U9.E6(DQ7) U13.L8(DQ7) U14.G6(I/O7)
D8: U9.F3(DQ8) U13.L2(DQ8) U14.B1(I/O8)
D9: U9.G3(DQ9) U13.M3(DQ9) U14.C1(I/O9)
D10: U9.F4(DQ10) U13.M2(DQ10) U14.C2(I/O10)
D11: U9.G4(DQ11) U13.P1(DQ11) U14.D2(I/O11)
D12: U9.F5(DQ12) U13.N2(DQ12) U14.E2(I/O12)
D13: U9.G6(DQ13) U13.R1(DQ13) U14.F2(I/O13)
D14: U9.F6(DQ14) U13.N3(DQ14) U14.F1(I/O14)
D15: U9.G7(DQ15A-1) U13.R2(DQ15) U14.G1(I/O15)
D16: U13.E8(DQ16)
D17: U13.D7(DQ17)
D18: U13.D8(DQ18)
D19: U13.B9(DQ19)
D20: U13.C8(DQ20)
D21: U13.A9(DQ21)
D22: U13.C7(DQ22)
D23: U13.A8(DQ23)
D24: U13.A2(DQ24)
D25: U13.C3(DQ25)
D26: U13.A1(DQ26)
D27: U13.C2(DQ27)
D28: U13.B1(DQ28)
D29: U13.D2(DQ29)
D30: U13.D3(DQ30)
D31: U13.E2(DQ31)
PD4: U9.G2(~{G}) U14.A2(~{OE}) ; port FMC_NOE
PD5: R107.2 ; port FMC_NWE
PD7: R91.2 ; port FMC_NE1
PE0: U13.K9(DQM0) U14.A1(~{BLE}) ; port FMC_NBL0
PE1: U13.K1(DQM1) U14.B2(~{BHE}) ; port FMC_NBL1
PF11: U13.J9(RAS#) ; port SDNRAS
PG8: U13.J1(CLK) ; port SDCLK
PG10: R147.2 ; port FMC_NE3
PG15: U13.K7(CAS#) ; port SDNCAS
PH2: R287.2 ; port SDCKE0
PH3: U13.J8(CS#) ; port SDNE0
PH5: U13.K8(WE#) ; port SDNWE
PI4: U13.F8(DQM2) ; port FMC_NBL2
PI5: U13.F2(DQM3) ; port FMC_NBL3
NetC40_1: C40.1 R85.2 U9.B5(~{RP})
NetCN11_6: R92.1 U9.A4(R~{B}) ; port FMC_NWAIT
NetJP10_2: JP10.2(NO) R116.1 U9.B4(Vpp/~{WP})
NetR90_1: R90.1 R91.1 U9.F2(~{E})
NetR107_1: R107.1 U9.A5(~{W}) U14.G5(~{WE})
NetR146_1: R146.1 R147.1 U14.B5(~{CE})
NetR285_1: R285.1 U9.F7(~{BYTE})
NetR287_1: R287.1 U13.J2(CKE)

Not connected (* = marked no-connect by the designer): U13 E3(NC) E7(NC) H3(NC) H7(NC) K2(NU) K3(NC)

### Buses and harness runs
bus A[0..23] = port A[0..23]
bus D[0..31] = port D[0..31]

### Notes on the sheet
- PH5
- (near R287) PG15
- (near R147) PG10
- (near R287) PF11
- (near R287) PH3
- (near R287) PH2
- (near R287) PG8
- (near R147) PE1
- (near R147) PE0
- FMC_NBL1
- FMC_NBL0
- (near R287) PI5
- (near R287) PI4
- SRAM
- PD5
- PD7
- PD6
- PD4
- (near U9) Nor Flash
- (near JP10) Default setting: Open
- (near U13) SDRAM
- Place close SRAM
- Place close Nor Flash
- Place close SDRAM
- Title:
- Project:
- Size:
- Date:
- A4
- Reference:
- Sheet:
- Revision:
- of

### Library data of the parts
C40 C145 C148-C165 = Cap: Capacitor; Value: 10nF; Published: 8-Jun-2000; Revision: July-2002: Re-released for DXP Platform.; Publisher: Altium Limited
JP10 = JP2
R85 R90-R92 R107 R116 R146 R147 R285 R287 = Res1: Resistor; Value: 1K; Published: 8-Jun-2000; Revision: July-2002: Re-released for DXP Platform.; Publisher: Altium Limited
U9 = M29W128FL70ZA6E
U13 = MT48LC4M32B2B5